# EAGLE design Mounts-Rev4 (EAGLE 9.6.2)

## Sheet 1 of 2
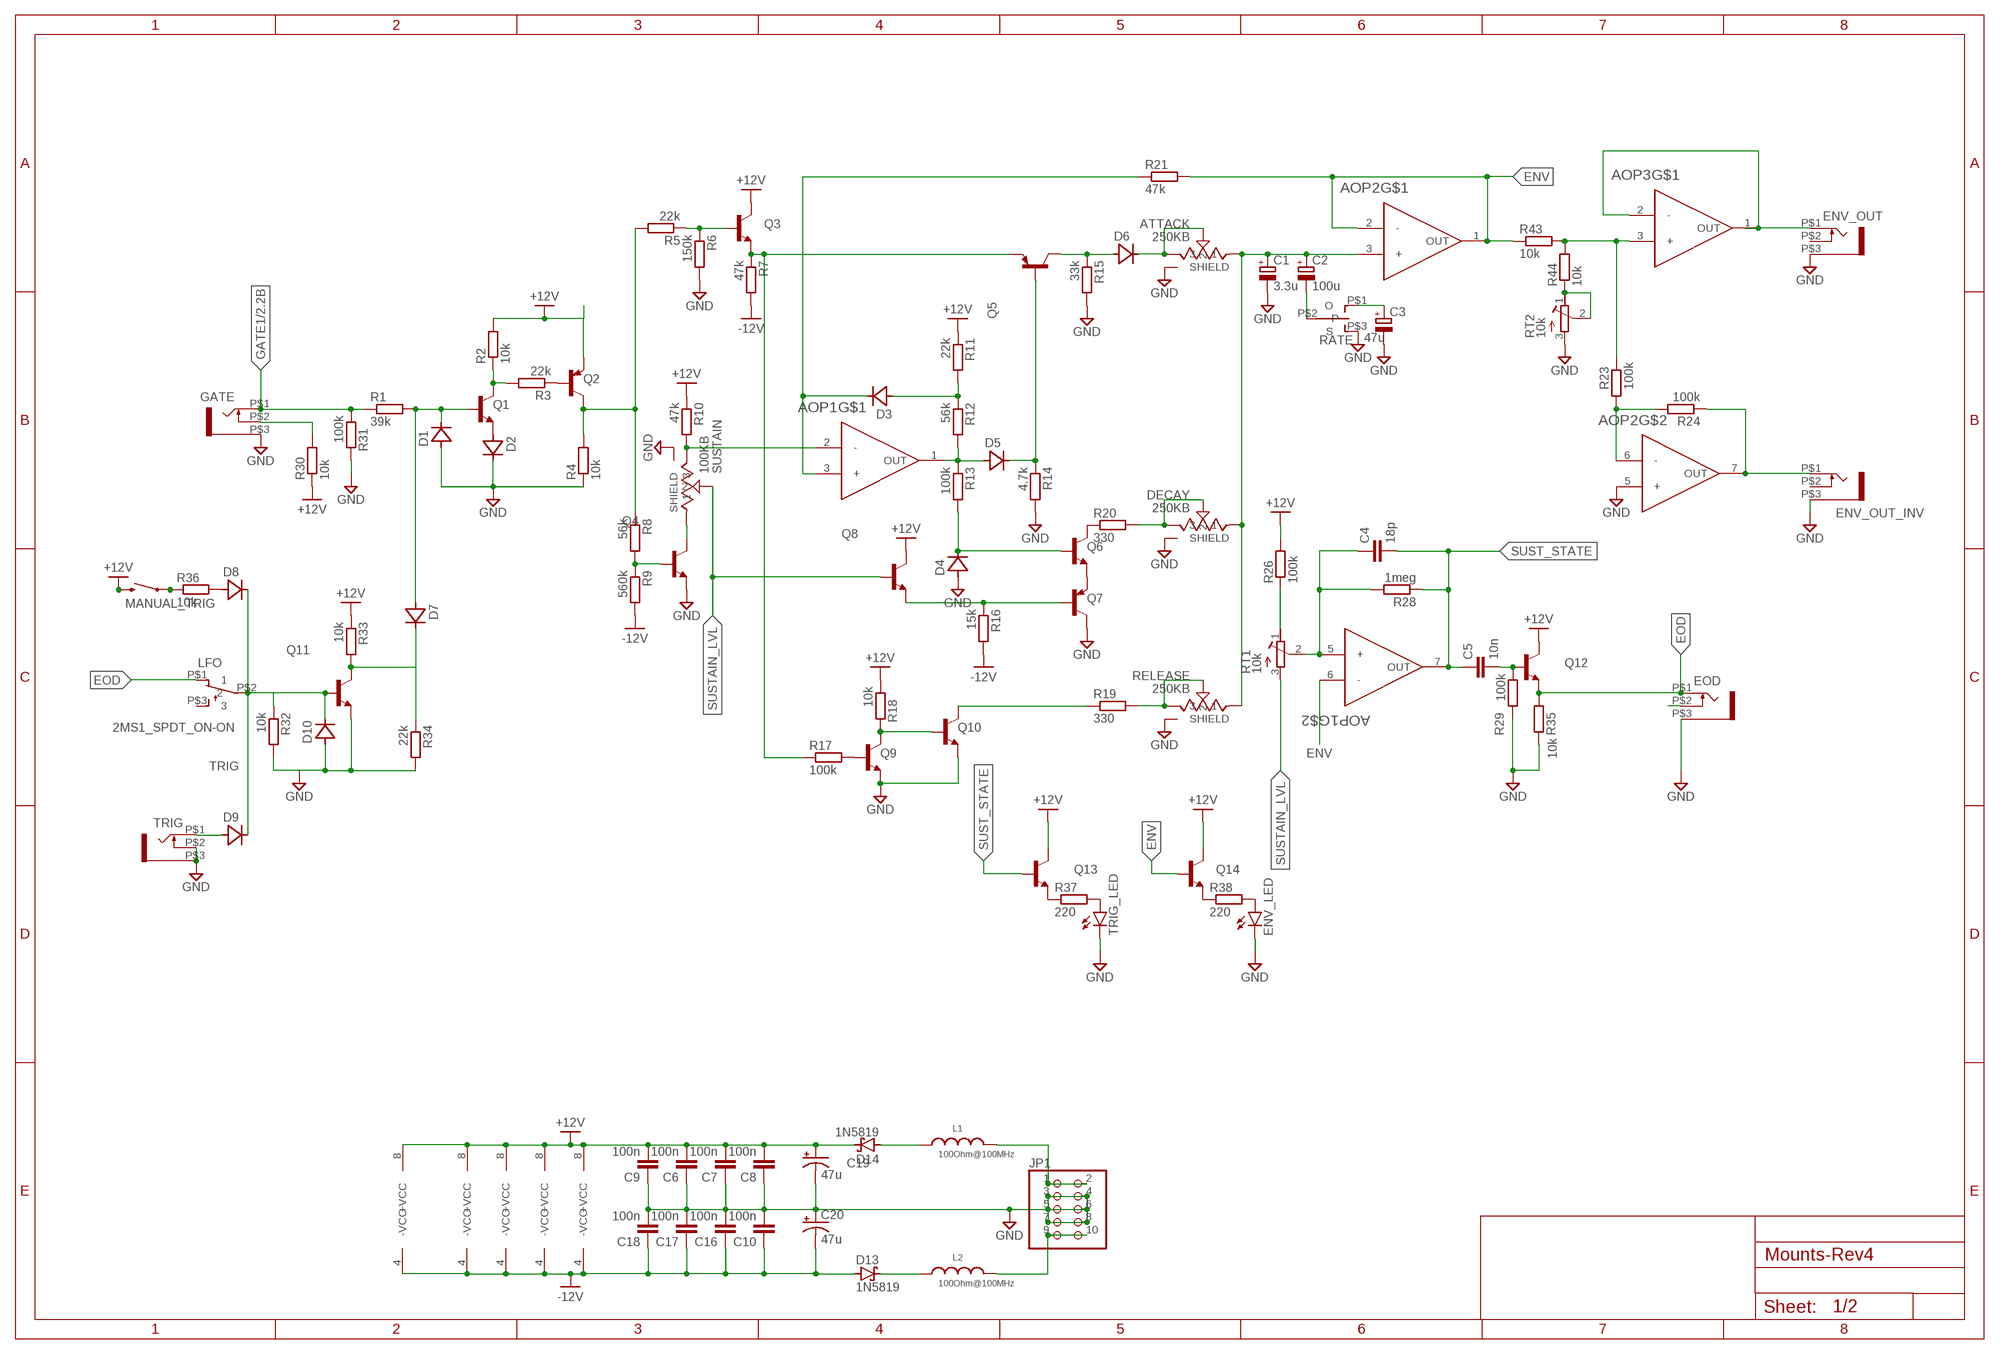
[diagram p0: schematic, sheet 1]

### Parts
AOP1  TL072ACDR  [SOIC8]
AOP2  TL072ACDR  [SOIC8]
AOP3  TL072ACDR  [SOIC8]
AOP5  TL072ACDR  [SOIC8]
AOP6  TL072ACDR  [SOIC8]
ATTACK  250KB  PTA2043  [TRIM_PTA2043-2015CPB]
C1  3.3u  CPOL-EU153CLV-0405  [153CLV-0405]
C2  100u  CPOL-EU153CLV-0605  [153CLV-0605]
C3  47u  CPOL-EU153CLV-0605  [153CLV-0605]
C4  18p  C-EUC0603  [C0603]
C5  10n  C-EUC0603  [C0603]
C6  100n  C-EUC0603  [C0603]
C7  100n  C-EUC0603  [C0603]
C8  100n  C-EUC0603  [C0603]
C9  100n  C-EUC0603  [C0603]
C10  100n  C-EUC0603  [C0603]
C16  100n  C-EUC0603  [C0603]
C17  100n  C-EUC0603  [C0603]
C18  100n  C-EUC0603  [C0603]
C19  47u  CPOL-USC  [PANASONIC_C]
C20  47u  CPOL-USC  [PANASONIC_C]
D1  1N4148WX  [SOD323-W]
D2  1N4148WX  [SOD323-W]
D3  1N4148WX  [SOD323-W]
D4  1N4148WX  [SOD323-W]
D5  1N4148WX  [SOD323-W]
D6  1N4148WX  [SOD323-W]
D7  1N4148WX  [SOD323-W]
D8  1N4148WX  [SOD323-W]
D9  1N4148WX  [SOD323-W]
D10  1N4148WX  [SOD323-W]
D13  1N5819  [SOD123]
D14  1N5819  [SOD123]
DECAY  250KB  PTA2043  [TRIM_PTA2043-2015CPB]
ENV_LED  LED3MM  [LED3MM]
ENV_OUT  WQP-PJ301M-12_JACK  [WQP-PJ301M-12_JACK]
ENV_OUT_INV  WQP-PJ301M-12_JACK  [WQP-PJ301M-12_JACK]
EOD  WQP-PJ301M-12_JACK  [WQP-PJ301M-12_JACK]
GATE  WQP-PJ301M-12_JACK  [WQP-PJ301M-12_JACK]
JP1  PINHD-2X5  [2X05]
L1  100Ohm@100MHz  WE-CBA_0603_782631101_WB/HS  [WE-CBA_0603(W=2.2)]
L2  100Ohm@100MHz  WE-CBA_0603_782631101_WB/HS  [WE-CBA_0603(W=2.2)]
LFO  2MS1_SPDT_ON-ON  [5FS1_SPDT]
MANUAL_TRIG  MOMENTARY-SWITCH-SPST-PTH-6.0MM  [TACTILE_SWITCH_PTH_6.0MM]
Q1  MMBT3904  [SOT23]
Q2  MMBT3906  [SOT23]
Q3  MMBT3904  [SOT23]
Q4  MMBT3904  [SOT23]
Q5  MMBT3906  [SOT23]
Q6  MMBT3904  [SOT23]
Q7  MMBT3906  [SOT23]
Q8  MMBT3904  [SOT23]
Q9  MMBT3904  [SOT23]
Q10  MMBT3904  [SOT23]
Q11  MMBT3904  [SOT23]
Q12  MMBT3904  [SOT23]
Q13  MMBT3904  [SOT23]
Q14  MMBT3904  [SOT23]
R1  39k  R-EU_R0603  [R0603]
R2  10k  R-EU_R0603  [R0603]
R3  22k  R-EU_R0603  [R0603]
R4  10k  R-EU_R0603  [R0603]
R5  22k  R-EU_R0603  [R0603]
R6  150k  R-EU_R0603  [R0603]
R7  47k  R-EU_R0603  [R0603]
R8  56k  R-EU_R0603  [R0603]
R9  560k  R-EU_R0603  [R0603]
R10  47k  R-EU_R0603  [R0603]
R11  22k  R-EU_R0603  [R0603]
R12  56k  R-EU_R0603  [R0603]
R13  100k  R-EU_R0603  [R0603]
R14  4.7k  R-EU_R0603  [R0603]
R15  33k  R-EU_R0603  [R0603]
R16  15k  R-EU_R0603  [R0603]
R17  100k  R-EU_R0603  [R0603]
R18  10k  R-EU_R0603  [R0603]
R19  330  R-EU_R0603  [R0603]
R20  330  R-EU_R0603  [R0603]
R21  47k  R-EU_R0603  [R0603]
R23  100k  R-EU_R0603  [R0603]
R24  100k  R-EU_R0603  [R0603]
R26  100k  R-EU_R0603  [R0603]
R28  1meg  R-EU_R0603  [R0603]
R29  100k  R-EU_R0603  [R0603]
R30  10k  R-EU_R0603  [R0603]
R31  100k  R-EU_R0603  [R0603]
R32  10k  R-EU_R0603  [R0603]
R33  10k  R-EU_R0603  [R0603]
R34  22k  R-EU_R0603  [R0603]
R35  10k  R-EU_R0603  [R0603]
R36  10k  R-EU_R0603  [R0603]
R37  220  R-EU_R0603  [R0603]
R38  220  R-EU_R0603  [R0603]
R43  10k  R-EU_R0603  [R0603]
R44  10k  R-EU_R0603  [R0603]
RATE  5FS1_SPDT_ON-OFF-ON  [5FS1_SPDT]
RELEASE  250KB  PTA2043  [TRIM_PTA2043-2015CPB]
RT1  10k  R-TRIMM3314G  [RTRIM3314G]
RT2  10k  R-TRIMM3314G  [RTRIM3314G]
SUSTAIN  100KB  PTA2043  [TRIM_PTA2043-2015CPB]
TRIG  WQP-PJ301M-12_JACK  [WQP-PJ301M-12_JACK]
TRIG_LED  LED3MM  [LED3MM]

### Nets
ENV: AOP1.6(-) AOP2.1(OUT) AOP2.2(-) Q14.1(B) R21.2 R43.1
EOD: EOD.P$1 LFO.P$1 Q12.2(E) R35.1
GATE1: GATE.P$1 R1.1 R31.1 ; also sheet 2
GND: AOP2.5(+) ATTACK.P1(SHIELD) ATTACK.P2(SHIELD) ATTACK.P3(SHIELD) ATTACK.P4(SHIELD) C1.- C3.- C6.1 C7.1 C8.1 C9.1 C10.2 C16.2 C17.2 C18.2 C19.- C20.+ D1.A D2.C D4.A D10.A DECAY.P1(SHIELD) DECAY.P2(SHIELD) DECAY.P3(SHIELD) DECAY.P4(SHIELD) ENV_LED.K(C) ENV_OUT.P$3 ENV_OUT_INV.P$3 EOD.P$3 GATE.P$3 JP1.3 JP1.4 JP1.5 JP1.6 JP1.7 JP1.8 Q4.2(E) Q7.3(C) Q9.2(E) Q10.2(E) Q11.2(E) R4.1 R6.2 R14.2 R15.2 R29.2 R31.2 R32.2 R34.2 R35.2 RATE.P$3(S) RELEASE.P1(SHIELD) RELEASE.P2(SHIELD) RELEASE.P3(SHIELD) RELEASE.P4(SHIELD) RT2.3(A) SUSTAIN.P1(SHIELD) SUSTAIN.P2(SHIELD) SUSTAIN.P3(SHIELD) SUSTAIN.P4(SHIELD) TRIG.P$2 TRIG.P$3 TRIG_LED.K(C) ; also sheet 2
N$2: D2.A Q1.2(E)
N$3: D1.C D7.A Q1.1(B) R1.2
N$4: Q3.1(B) R5.1 R6.1
N$5: Q2.1(B) R3.1
N$6: JP1.1 JP1.2 L1.2
N$7: Q1.3(C) R2.1 R3.2
N$8: AOP1.3(+) D3.C R21.1
N$9: Q3.2(E) Q5.2(E) R7.1 R17.1
N$10: Q4.1(B) R8.2 R9.1
N$11: AOP1.5(+) C4.1 R28.2 RT1.2(S)
N$12: Q6.2(E) Q7.2(E)
N$13: D3.A R11.2 R12.1
N$14: AOP1.1(OUT) D5.A R12.2 R13.1
N$15: D4.C Q6.1(B) R13.2
N$16: D5.C Q5.1(B) R14.1
N$17: D6.A Q5.3(C) R15.1
N$18: ATTACK.2 ATTACK.3 D6.C
N$19: Q7.1(B) Q8.2(E) R16.1
N$20: Q9.1(B) R17.2
N$21: AOP1.2(-) R10.2 SUSTAIN.3
N$22: Q9.3(C) Q10.1(B) R18.2
N$23: Q10.3(C) R19.1
N$24: Q6.3(C) R20.1
N$25: DECAY.2 DECAY.3 R20.2
N$26: R19.2 RELEASE.2 RELEASE.3
N$27: AOP2.3(+) ATTACK.1 C1.+ C2.+ DECAY.1 RELEASE.1
N$28: Q4.3(C) SUSTAIN.1
N$29: AOP2.6(-) R23.1 R24.2
N$30: AOP3.1(OUT) AOP3.2(-) ENV_OUT.P$1
N$31: GATE.P$2 R30.2
N$32: Q2.3(C) R4.2 R5.2 R8.1
N$33: R26.1 RT1.1(E)
N$35: D8.A R36.2
N$36: R44.1 RT2.1(E) RT2.2(S)
N$37: D9.A TRIG.P$1
N$38: D7.C Q11.3(C) R33.2 R34.1
N$39: C5.2 Q12.1(B) R29.1
N$40: MANUAL_TRIG.3 R36.1
N$41: C2.- RATE.P$2(P)
N$42: C3.+ RATE.P$1(O)
N$43: Q13.2(E) R37.1
N$44: R37.2 TRIG_LED.A
N$45: Q14.2(E) R38.1
N$46: ENV_LED.A R38.2
N$48: AOP2.7(OUT) ENV_OUT_INV.P$1 R24.1
N$49: AOP3.3(+) R23.2 R43.2 R44.2
N$56: JP1.9 JP1.10 L2.2
N$57: D14.A L1.1
N$59: D13.C L2.1
N$69: EOD.P$2
SUST_STATE: AOP1.7(OUT) C4.2 C5.1 Q13.1(B) R28.1
SUSTAIN_LVL: Q8.1(B) RT1.3(A) SUSTAIN.2
TRIG: D8.C D9.C D10.C LFO.P$2 Q11.1(B) R32.1
VCC: AOP1.8(+VCC) AOP2.8(+VCC) AOP3.8(+VCC) AOP5.8(+VCC) AOP6.8(+VCC) C6.2 C7.2 C8.2 C9.2 C19.+ D14.C MANUAL_TRIG.1 Q2.2(E) Q3.3(C) Q8.3(C) Q12.3(C) Q13.3(C) Q14.3(C) R2.2 R10.1 R11.1 R18.1 R26.2 R30.1 R33.1 ; supply symbol labelled +12V ; also sheet 2
VDD: AOP1.4(-VCC) AOP2.4(-VCC) AOP3.4(-VCC) AOP5.4(-VCC) AOP6.4(-VCC) C10.1 C16.1 C17.1 C18.1 C20.- D13.A R7.2 R9.2 R16.2 ; supply symbol labelled -12V ; also sheet 2
Unconnected: ENV_OUT.P$2 ENV_OUT_INV.P$2 LFO.P$3

## Sheet 2 of 2
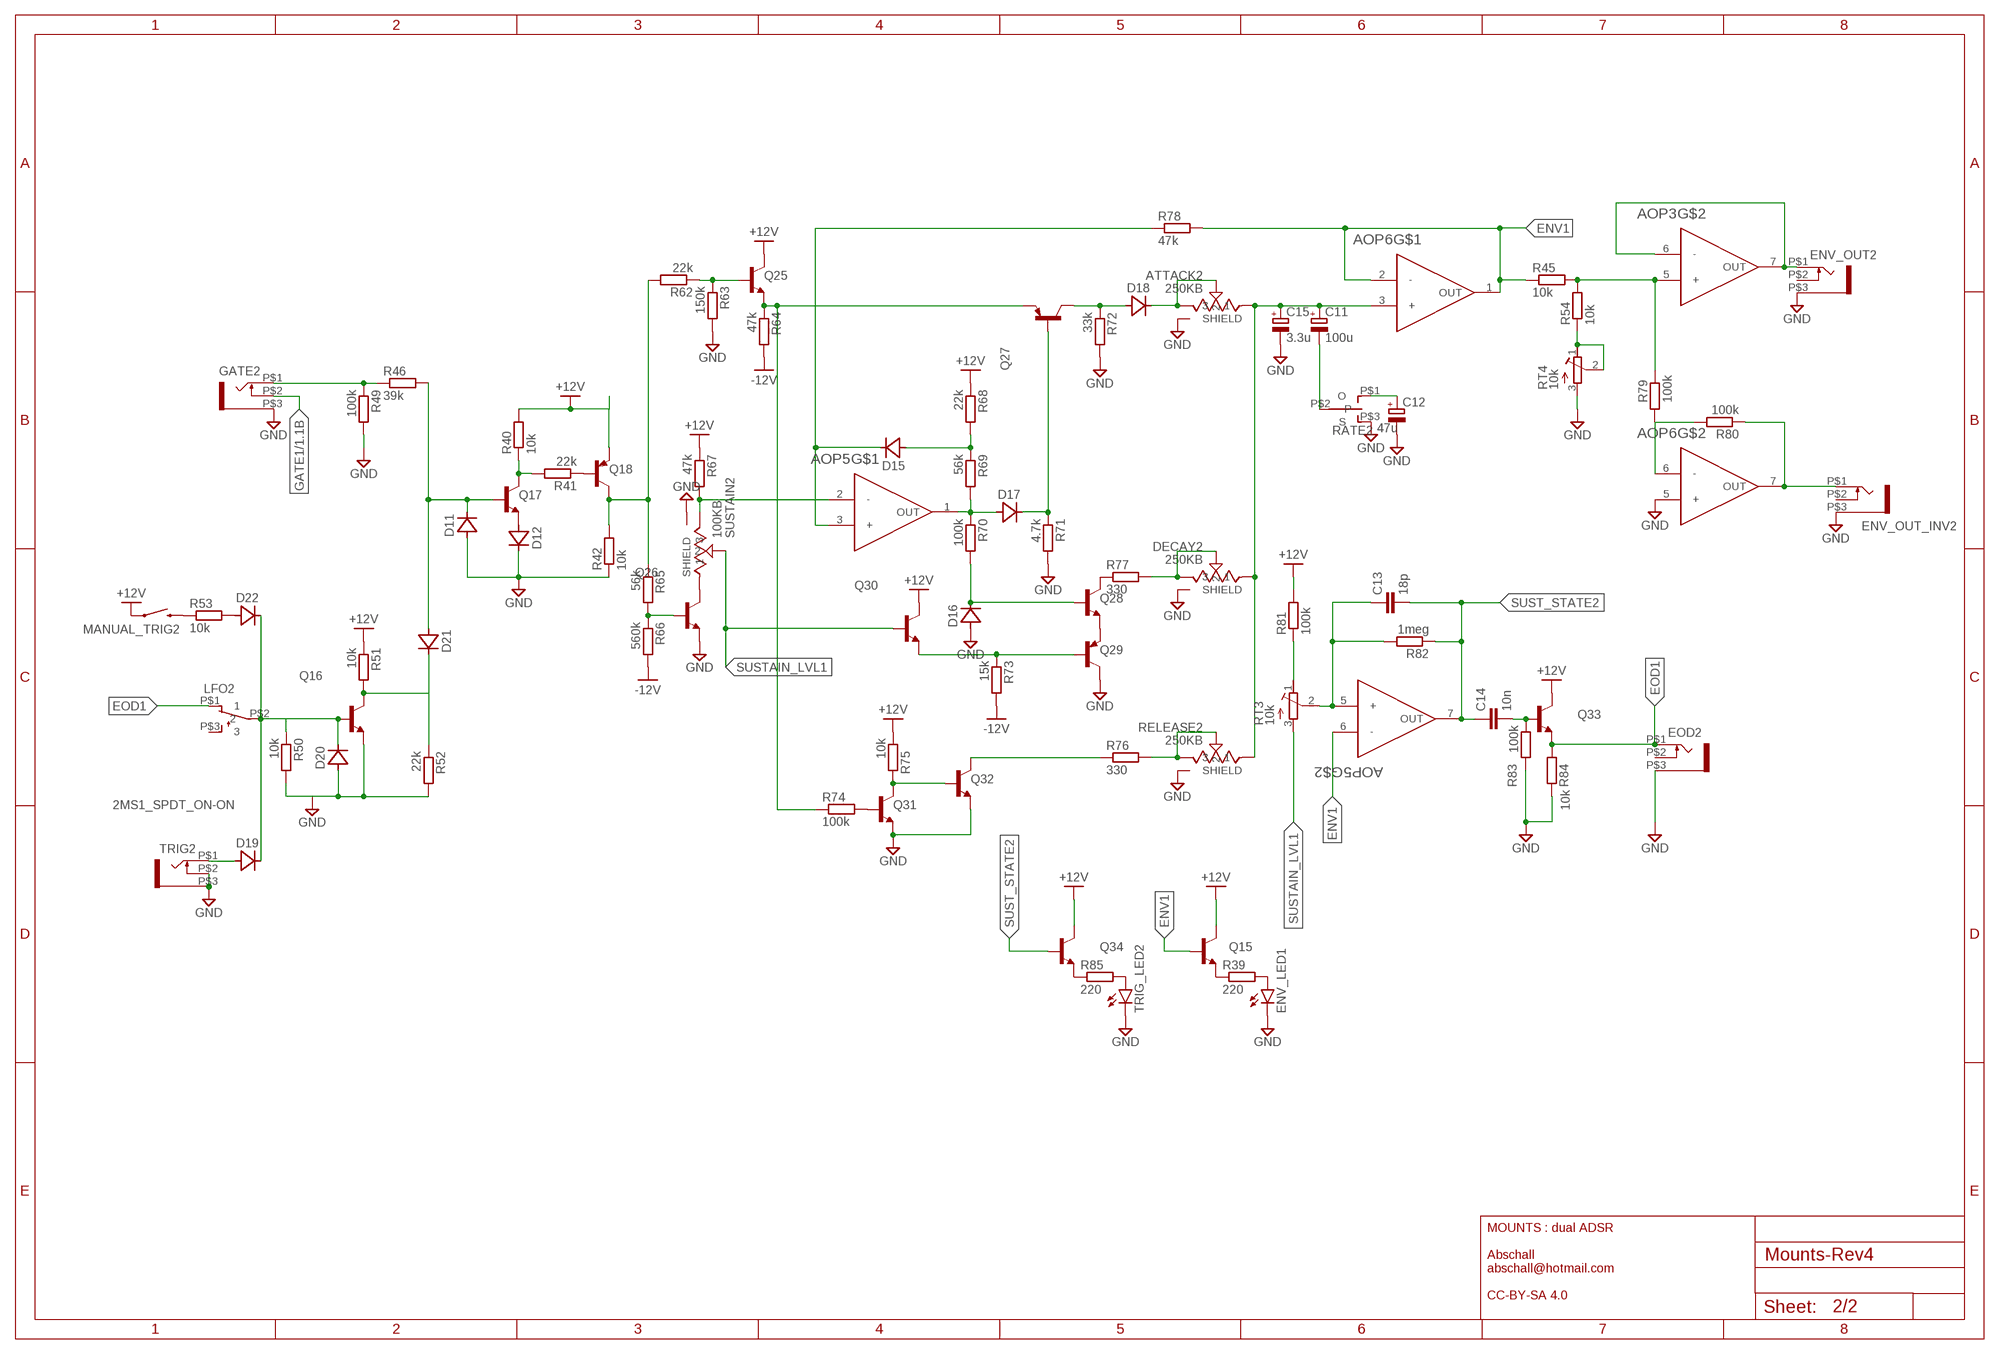
[diagram p1: schematic, sheet 2]

### Parts
ATTACK2  250KB  PTA2043  [TRIM_PTA2043-2015CPB]
C11  100u  CPOL-EU153CLV-0605  [153CLV-0605]
C12  47u  CPOL-EU153CLV-0605  [153CLV-0605]
C13  18p  C-EUC0603  [C0603]
C14  10n  C-EUC0603  [C0603]
C15  3.3u  CPOL-EU153CLV-0405  [153CLV-0405]
D11  1N4148WX  [SOD323-W]
D12  1N4148WX  [SOD323-W]
D15  1N4148WX  [SOD323-W]
D16  1N4148WX  [SOD323-W]
D17  1N4148WX  [SOD323-W]
D18  1N4148WX  [SOD323-W]
D19  1N4148WX  [SOD323-W]
D20  1N4148WX  [SOD323-W]
D21  1N4148WX  [SOD323-W]
D22  1N4148WX  [SOD323-W]
DECAY2  250KB  PTA2043  [TRIM_PTA2043-2015CPB]
ENV_LED1  LED3MM  [LED3MM]
ENV_OUT2  WQP-PJ301M-12_JACK  [WQP-PJ301M-12_JACK]
ENV_OUT_INV2  WQP-PJ301M-12_JACK  [WQP-PJ301M-12_JACK]
EOD2  WQP-PJ301M-12_JACK  [WQP-PJ301M-12_JACK]
GATE2  WQP-PJ301M-12_JACK  [WQP-PJ301M-12_JACK]
LFO2  2MS1_SPDT_ON-ON  [5FS1_SPDT]
MANUAL_TRIG2  MOMENTARY-SWITCH-SPST-PTH-6.0MM  [TACTILE_SWITCH_PTH_6.0MM]
Q15  MMBT3904  [SOT23]
Q16  MMBT3904  [SOT23]
Q17  MMBT3904  [SOT23]
Q18  MMBT3906  [SOT23]
Q25  MMBT3904  [SOT23]
Q26  MMBT3904  [SOT23]
Q27  MMBT3906  [SOT23]
Q28  MMBT3904  [SOT23]
Q29  MMBT3906  [SOT23]
Q30  MMBT3904  [SOT23]
Q31  MMBT3904  [SOT23]
Q32  MMBT3904  [SOT23]
Q33  MMBT3904  [SOT23]
Q34  MMBT3904  [SOT23]
R39  220  R-EU_R0603  [R0603]
R40  10k  R-EU_R0603  [R0603]
R41  22k  R-EU_R0603  [R0603]
R42  10k  R-EU_R0603  [R0603]
R45  10k  R-EU_R0603  [R0603]
R46  39k  R-EU_R0603  [R0603]
R49  100k  R-EU_R0603  [R0603]
R50  10k  R-EU_R0603  [R0603]
R51  10k  R-EU_R0603  [R0603]
R52  22k  R-EU_R0603  [R0603]
R53  10k  R-EU_R0603  [R0603]
R54  10k  R-EU_R0603  [R0603]
R62  22k  R-EU_R0603  [R0603]
R63  150k  R-EU_R0603  [R0603]
R64  47k  R-EU_R0603  [R0603]
R65  56k  R-EU_R0603  [R0603]
R66  560k  R-EU_R0603  [R0603]
R67  47k  R-EU_R0603  [R0603]
R68  22k  R-EU_R0603  [R0603]
R69  56k  R-EU_R0603  [R0603]
R70  100k  R-EU_R0603  [R0603]
R71  4.7k  R-EU_R0603  [R0603]
R72  33k  R-EU_R0603  [R0603]
R73  15k  R-EU_R0603  [R0603]
R74  100k  R-EU_R0603  [R0603]
R75  10k  R-EU_R0603  [R0603]
R76  330  R-EU_R0603  [R0603]
R77  330  R-EU_R0603  [R0603]
R78  47k  R-EU_R0603  [R0603]
R79  100k  R-EU_R0603  [R0603]
R80  100k  R-EU_R0603  [R0603]
R81  100k  R-EU_R0603  [R0603]
R82  1meg  R-EU_R0603  [R0603]
R83  100k  R-EU_R0603  [R0603]
R84  10k  R-EU_R0603  [R0603]
R85  220  R-EU_R0603  [R0603]
RATE2  5FS1_SPDT_ON-OFF-ON  [5FS1_SPDT]
RELEASE2  250KB  PTA2043  [TRIM_PTA2043-2015CPB]
RT3  10k  R-TRIMM3314G  [RTRIM3314G]
RT4  10k  R-TRIMM3314G  [RTRIM3314G]
SUSTAIN2  100KB  PTA2043  [TRIM_PTA2043-2015CPB]
TRIG2  WQP-PJ301M-12_JACK  [WQP-PJ301M-12_JACK]
TRIG_LED2  LED3MM  [LED3MM]

### Nets
ENV1: AOP5.6(-) AOP6.1(OUT) AOP6.2(-) Q15.1(B) R45.1 R78.2
EOD1: EOD2.P$1 LFO2.P$1 Q33.2(E) R84.1
GATE1: GATE2.P$2 ; also sheet 1
GND: AOP6.5(+) ATTACK2.P1(SHIELD) ATTACK2.P2(SHIELD) ATTACK2.P3(SHIELD) ATTACK2.P4(SHIELD) C12.- C15.- D11.A D12.C D16.A D20.A DECAY2.P1(SHIELD) DECAY2.P2(SHIELD) DECAY2.P3(SHIELD) DECAY2.P4(SHIELD) ENV_LED1.K(C) ENV_OUT2.P$3 ENV_OUT_INV2.P$3 EOD2.P$3 GATE2.P$3 Q16.2(E) Q26.2(E) Q29.3(C) Q31.2(E) Q32.2(E) R42.1 R49.2 R50.2 R52.2 R63.2 R71.2 R72.2 R83.2 R84.2 RATE2.P$3(S) RELEASE2.P1(SHIELD) RELEASE2.P2(SHIELD) RELEASE2.P3(SHIELD) RELEASE2.P4(SHIELD) RT4.3(A) SUSTAIN2.P1(SHIELD) SUSTAIN2.P2(SHIELD) SUSTAIN2.P3(SHIELD) SUSTAIN2.P4(SHIELD) TRIG2.P$2 TRIG2.P$3 TRIG_LED2.K(C) ; also sheet 1
N$1: AOP6.6(-) R79.1 R80.2
N$34: AOP3.5(+) R45.2 R54.2 R79.2
N$47: D12.A Q17.2(E)
N$50: Q15.2(E) R39.1
N$51: ENV_LED1.A R39.2
N$52: D11.C D21.A Q17.1(B) R46.2
N$53: Q18.1(B) R41.1
N$54: Q17.3(C) R40.1 R41.2
N$55: Q18.3(C) R42.2 R62.2 R65.1
N$58: GATE2.P$1 R46.1 R49.1
N$60: R54.1 RT4.1(E) RT4.2(S)
N$61: D21.C Q16.3(C) R51.2 R52.1
N$62: D19.A TRIG2.P$1
N$63: D22.A R53.2
N$64: MANUAL_TRIG2.3 R53.1
N$65: AOP3.6(-) AOP3.7(OUT) ENV_OUT2.P$1
N$70: AOP5.2(-) R67.2 SUSTAIN2.3
N$71: Q26.3(C) SUSTAIN2.1
N$84: Q25.1(B) R62.1 R63.1
N$85: Q25.2(E) Q27.2(E) R64.1 R74.1
N$86: Q26.1(B) R65.2 R66.1
N$87: AOP5.3(+) D15.C R78.1
N$88: D15.A R68.2 R69.1
N$89: AOP5.1(OUT) D17.A R69.2 R70.1
N$90: D16.C Q28.1(B) R70.2
N$91: D17.C Q27.1(B) R71.1
N$92: D18.A Q27.3(C) R72.1
N$93: ATTACK2.2 ATTACK2.3 D18.C
N$94: Q28.2(E) Q29.2(E)
N$95: Q29.1(B) Q30.2(E) R73.1
N$97: Q31.1(B) R74.2
N$98: Q31.3(C) Q32.1(B) R75.2
N$99: Q32.3(C) R76.1
N$100: Q28.3(C) R77.1
N$101: DECAY2.2 DECAY2.3 R77.2
N$102: R76.2 RELEASE2.2 RELEASE2.3
N$103: AOP6.3(+) ATTACK2.1 C11.+ C15.+ DECAY2.1 RELEASE2.1
N$105: AOP6.7(OUT) ENV_OUT_INV2.P$1 R80.1
N$106: R81.1 RT3.1(E)
N$107: AOP5.5(+) C13.1 R82.2 RT3.2(S)
N$109: C14.2 Q33.1(B) R83.1
N$110: C11.- RATE2.P$2(P)
N$111: C12.+ RATE2.P$1(O)
N$112: Q34.2(E) R85.1
N$113: R85.2 TRIG_LED2.A
SUST_STATE2: AOP5.7(OUT) C13.2 C14.1 Q34.1(B) R82.1
SUSTAIN_LVL1: Q30.1(B) RT3.3(A) SUSTAIN2.2
TRIG1: D19.C D20.C D22.C LFO2.P$2 Q16.1(B) R50.1
VCC: MANUAL_TRIG2.1 Q15.3(C) Q18.2(E) Q25.3(C) Q30.3(C) Q33.3(C) Q34.3(C) R40.2 R51.1 R67.1 R68.1 R75.1 R81.2 ; supply symbol labelled +12V ; also sheet 1
VDD: R64.2 R66.2 R73.2 ; supply symbol labelled -12V ; also sheet 1
Unconnected: ENV_OUT2.P$2 ENV_OUT_INV2.P$2 EOD2.P$2 LFO2.P$3

### Notes on the sheet
- MOUNTS : dual ADSR
  
  Abschall
  abschall@hotmail.com
  
  CC-BY-SA 4.0

## Library data of the parts
AOP1 = personal devices:TL072ACDR; SPICEPREFIX: J
AOP2 AOP3 AOP5 AOP6 = personal devices:TL072ACDR
ATTACK ATTACK2 DECAY DECAY2 RELEASE RELEASE2 SUSTAIN SUSTAIN2 = potentiometer:PTA2043
C1-C3 C11 C12 C15 = resistor:CPOL-EU: POLARIZED CAPACITOR, European symbol
C4-C10 C13 C14 C16-C18 = resistor:C-EU: CAPACITOR, European symbol
C19 C20 = rcl:CPOL-US: POLARIZED CAPACITOR, American symbol
D1-D12 D15-D22 = personal devices:1N4148WX
D13 D14 = personal-ICs:1N5819
ENV_LED ENV_LED1 TRIG_LED TRIG_LED2 = led:LED: LED OSRAM: - CHIPLED LG R971, LG N971, LY N971, LG Q971, LY Q971, LO R971, LY R971 LH N974, LH R974 LS Q976, LO Q976, LY Q976 LO Q996 - Hyper CHIPLED LW Q18S LB Q993, LB Q99A, LB R99A - SideLED LS A670, LO A670, LY A670, LG A670, LP A670 LB A673, LV A673, LT A673, LW A673 LH A674 LY A675 LS A676, LA A676, LO A676, LY A676, LW A676 LS A679, LY A679, LG A679 - Hyper Micro SIDELED® LS Y876, LA Y876, LO Y876, LY Y876 LT Y87S - SmartLED LW L88C, LW L88S LB L89C, LB L89S, LG L890 LS L89K, LO L89K, LY L89K LS L896, LA L896, LO L896, LY L896 - TOPLED LS T670, LO T670, LY T670, LG T670, LP T670 LSG T670, LSP T670, LSY T670, LOP T670, LYG T670 LG T671, LOG T671, LSG T671 LB T673, LV T673, LT T673, LW T673 LH T674 LS T676, LA T676, LO T676, LY T676, LB T676, LH T676, LSB T676, LW T676 LB T67C, LV T67C, LT T67C, LS T67K, LO T67K, LY T67K, LW E67C LS E67B, LA E67B, LO E67B, LY E67B, LB E67C, LV E67C, LT E67C LW T67C LS T679, LY T679, LG T679 LS T770, LO T770, LY T770, LG T770, LP T770 LB T773, LV T773, LT T773, LW T773 LH T774 LS E675, LA E675, LY E675, LS T675 LS T776, LA T776, LO T776, LY T776, LB T776 LHGB T686 LT T68C, LB T68C - Hyper Mini TOPLED® LB M676 - Mini TOPLED Santana® LG M470 LS M47K, LO M47K, LY M47K Source: http://www.osram.convergy.de LUXEON: - LUMILED® LXK2-PW12-R00, LXK2-PW12-S00, LXK2-PW14-U00, LXK2-PW14-V00 LXK2-PM12-R00, LXK2-PM12-S00, LXK2-PM14-U00 LXK2-PE12-Q00, LXK2-PE12-R00, LXK2-PE12-S00, LXK2-PE14-T00, LXK2-PE14-U00 LXK2-PB12-K00, LXK2-PB12-L00, LXK2-PB12-M00, LXK2-PB14-N00, LXK2-PB14-P00, LXK2-PB14-Q00 LXK2-PR12-L00, LXK2-PR12-M00, LXK2-PR14-Q00, LXK2-PR14-R00 LXK2-PD12-Q00, LXK2-PD12-R00, LXK2-PD12-S00 LXK2-PH12-R00, LXK2-PH12-S00 LXK2-PL12-P00, LXK2-PL12-Q00, LXK2-PL12-R00 Source: www.luxeon.com KINGBRIGHT: KA-3528ASYC Source: www.kingbright.com
ENV_OUT ENV_OUT2 ENV_OUT_INV ENV_OUT_INV2 EOD EOD2 GATE GATE2 TRIG TRIG2 = thonkiconn:WQP-PJ301M-12_JACK
JP1 = pinhead:PINHD-2X5: PIN HEADER
L1 L2 = Wurth_Automotive_WE-CBA:WE-CBA_0603: WE-CBA SMD EMI Suppression Ferrite Bead Characteristics Reliable Ni-Sn electrodes High rated current up to 5A Recommended soldering: Reflow Operating temperature: -55°C to +125°C Applications * Perfect as data line filter and for uncoupling of distribution voltage *This special SMD chip bead ferrites can be put directly on the printed circuit board. They offer excellent anti-EMI properties and low DC-resistance. Placed very close next to the interference source even with smallest size 0402,maximal impedance at 1000 Ω can be reached. *High Speed: "High Speed " SMD ferrites WE-CBF have lower impedance in the lower frequency ranges thus they have only a low attenuation for fast signals. Application e.g. USB 2.0, IEEE 1394,LVDS *Wide Band: "Wide Band" SMD ferrites WE-CBF already show high impedance in low frequency range. Therefore they are wide band through the whole spectrum. Application e.g. control signats, RS232, RS422, DC/DC converter *High Current: "High Current " SMD ferrites WE-CBF are designed for high current (over 1 A). The rated current refers to 40K self-heating. High current SMD ferrites are available in all there types (High Speed, Wide Band and High Frequency). Application e.g. power supply, DC/DC converter *Advice: Pay attention for the use of SMD-Ferrites for high current>1A and ambient temperature over +85°C that the rated current has to be reduced when temperature is above +85°C (Derating). *At+100°C environment temperature the maximal rated current has to add up to only 60% of the data sheet value ,without an overload of the component. Variant abbreviation WB means WIDE BAND HS means HIGH SPEED HC means HIGH CURRENT <https://katalog.we-online.de/media/images/v2/o14751v209%20Family_WE-CBA.jpg> Details see: https://www.we-online.com/catalog/en/WE-CBA/ Updated by Ella Wu 2019-12-09 2019(C) Wurth Elektronik; DATASHEET-URL: https://www.we-online.com/catalog/datasheet/782631101.pdf; IR1: 500mA; MOUNT: SMT; PART-NUMBER: 782631101; RDC-MAX: 0.2Ohm; TYPE: High Speed; ZMAX: 610Ohm
LFO LFO2 = personal devices:2MS1_SPDT_ON-ON
MANUAL_TRIG MANUAL_TRIG2 = SparkFun-Switches:MOMENTARY-SWITCH-SPST: Momentary Switch (Pushbutton) - SPST Normally-open (NO) SPST momentary switches (buttons, pushbuttons). Variants PTH-12MM - 12mm square, through-hole Momentary Pushbutton Switch - 12mm Square <https://www.sparkfun.com/products/9190> (COM-09190) PTH-6.0MM, PTH-6.0MM-KIT - 6.0mm square, through-hole Mini Pushbutton Switch <https://www.sparkfun.com/products/97> (COM-00097) KIT package intended for soldering kit's - only one side of pads' copper is exposed. PTH-RIGHT-ANGLE-KIT - Right-angle, through-hole Right Angle Tactile Button <https://www.sparkfun.com/products/10791> - Used on SparkFun BigTime Watch Kit <https://www.sparkfun.com/products/11734> SMD-12MM - 12mm square, surface-mount Tactile Button - SMD (12mm) <https://www.sparkfun.com/products/12993> (COM-12993) Used on SparkFun PicoBoard <https://www.sparkfun.com/products/11888> SMD-4.5MM - 4.5mm Square Trackball Switch Used on SparkFun Blackberry Trackballer Breakout <https://www.sparkfun.com/products/13169> SMD-4.6MMX2.8MM - 4.60mm x 2.80mm, surface mount Used on SparkFun SAMD21 Mini Breakout <https://www.sparkfun.com/products/13664> SMD-5.2MM, SMD-5.2-REDUNDANT - 5.2mm square, surface-mount Mini Pushbutton Switch - SMD <https://www.sparkfun.com/products/8720> (COM-08720) Used on Arduino Pro Mini <https://www.sparkfun.com/products/11114> REDUNDANT package connects both switch circuits together SMD-6.0X3.5MM - 6.0 x 3.5mm, surface mount Momentary Reset Switch SMD <https://www.sparkfun.com/products/8229> (COM-08229) SMD-6.2MM-TALL - 6.2mm square, surface mount Tactile Button - SMD (6mm) <https://www.sparkfun.com/products/12992> Used on SparkFun Digital Sandbox <https://www.sparkfun.com/products/12651> SMD-RIGHT-ANGLE - Right-angle, surface mount Used on SparkFun Block for Intel® Edison - Arduino <https://www.sparkfun.com/products/13036>; PROD_ID: SWCH-08441; SF_SKU: COM-00097
Q1 Q3 Q4 Q6 Q8-Q17 Q25 Q26 Q28 Q30-Q34 = personal devices:MMBT3904
Q2 Q5 Q7 Q18 Q27 Q29 = personal devices:MMBT3906
R1-R21 R23 R24 R26 R28-R46 R49-R54 R62-R85 = resistor:R-EU_: RESISTOR, European symbol
RATE RATE2 = personal devices:5FS1_SPDT_ON-OFF-ON: 2.54 pin pitch slide switch ON-OFF-ON same footprint ass thonk mountain switch 2MS1
RT1-RT4 = resistor:R-TRIMM: Trimm resistor

## Board
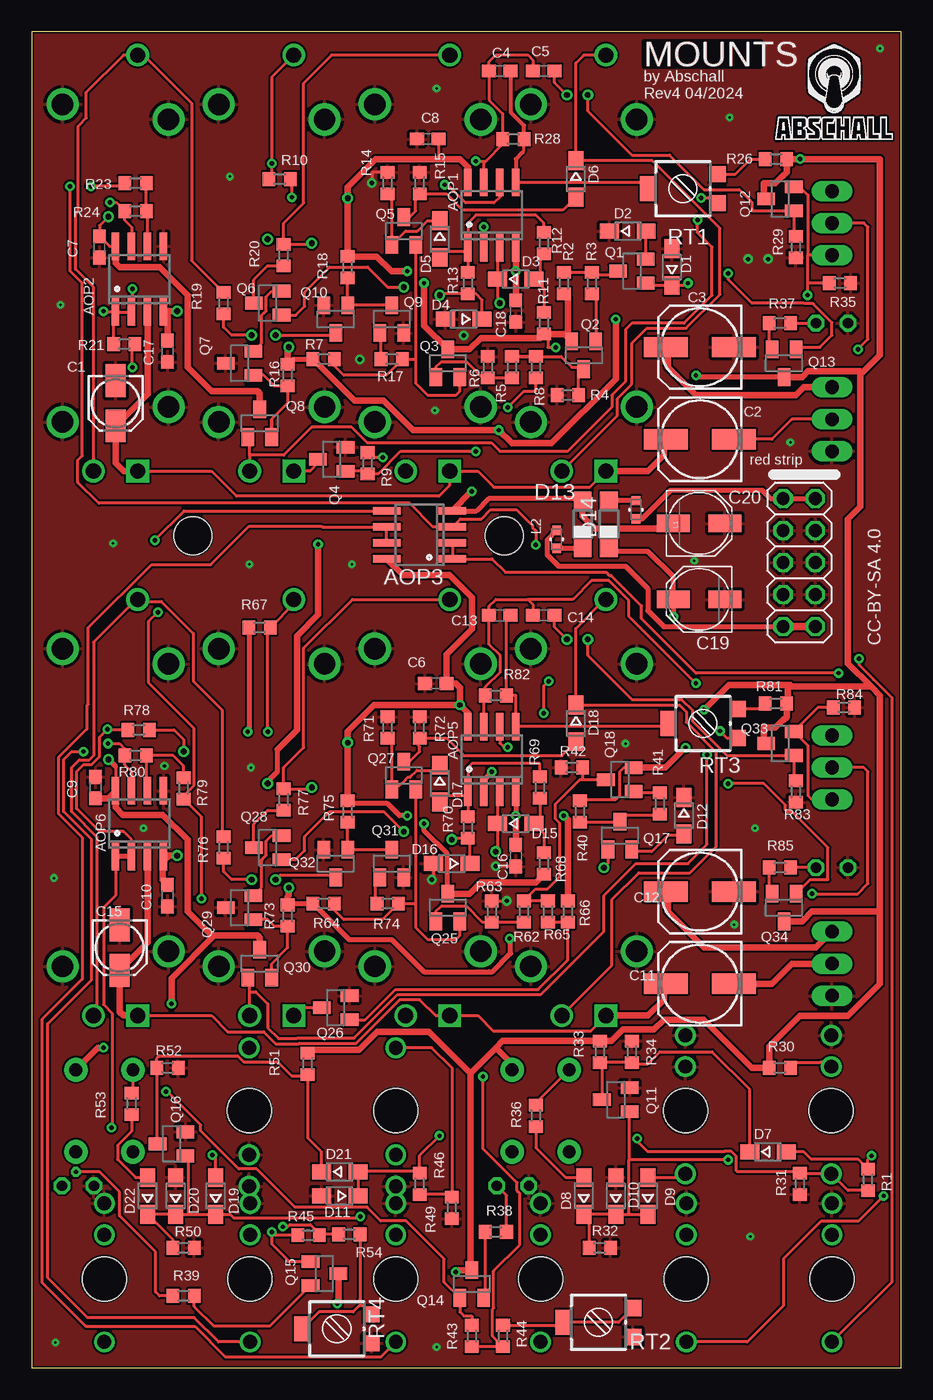
[diagram p2: board, top side]
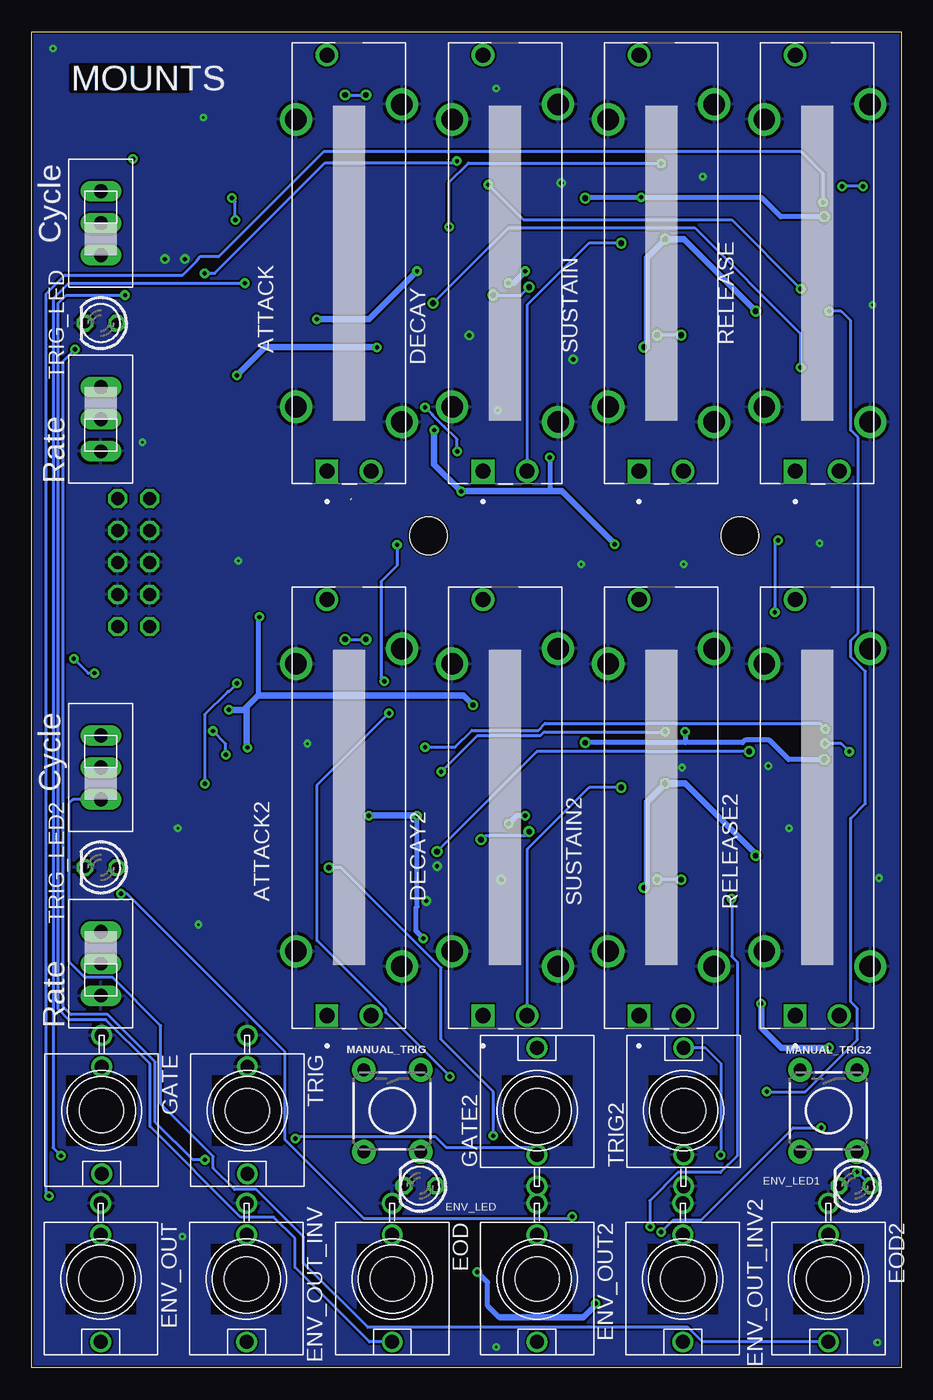
[diagram p3: board, bottom side, seen from below]

Size 69 x 106 mm. Coordinates in mm from the lower left corner, seen from the top.
Outline: 0,0 69,0 69,106 0,106 0,0
Copper layers (1*16): Top 0.035mm / dielectric 1.5mm / Bottom 0.035mm
Design rules "default *": minimum track width 6mil, minimum drill 0.35mm, track to track 6mil, track to pad 6mil, pad to pad 6mil, via to via 6mil, smd to smd 6mil, copper to edge 6mil, drill to drill 6mil, minimum pad ring 10mil, minimum via ring 8mil, stop-mask expansion 4mil, vias tented up to drill 0mil, thermal gap 10mil
Holes 3 mm at 12.8,66 37.5,66

### Footprints (pad centres in the part's own frame; a part is rotated, then mirrored left to right if it is on the bottom)
SOIC8 = smd 0.6 x 2.2: 1 -1.905,-2.6; 2 -0.635,-2.6; 3 0.635,-2.6; 4 1.905,-2.6; 5 1.905,2.6; 6 0.635,2.6; 7 -0.635,2.6; 8 -1.905,2.6
TRIM_PTA2043-2015CPB = drill 1.2 square: 1 -16.5,1.75 | drill 1.2: 2 -16.5,-1.75; 3 16.5,1.75 | drill 1.7: P1 -11.4,4.2; P2 11.4,4.2; P3 -12.6,-4.2; P4 12.6,-4.2
153CLV-0405 = smd 2.6 x 1.6: + 1.8,0; - -1.8,0
153CLV-0605 = smd 3.5 x 1.6: + 2.7,0; - -2.7,0
C0603 = smd 1.1 x 1: 1 -0.85,0; 2 0.85,0
PANASONIC_C = smd 2.6 x 1.4: + 2.05,0; - -2.05,0
SOD323-W = smd 1.5 x 1.2: A 1.45,0; C -1.45,0
SOD123 = smd 1.4 x 1.4: A 1.9,0; C -1.9,0
LED3MM = drill 0.813 octagon: A -1.27,0; K 1.27,0
WQP-PJ301M-12_JACK = drill 1.1: P$1 0,5; P$2 0,-3.5; P$3 0,-5.992 | hole 3.5: 0,0
2X05 = drill 1.016 octagon: 1 -5.08,-1.27; 2 -5.08,1.27; 3 -2.54,-1.27; 4 -2.54,1.27; 5 0,-1.27; 6 0,1.27; 7 2.54,-1.27; 8 2.54,1.27; 9 5.08,-1.27; 10 5.08,1.27
WE-CBA_0603(W=2.2) = smd 0.75 x 0.7: 1 -0.725,0; 2 0.725,0
5FS1_SPDT = drill 1.09 long: P$1 2.54,7.62; P$2 2.54,5.08; P$3 2.54,2.54
TACTILE_SWITCH_PTH_6.0MM = drill 1.016 pad 1.88: 1 -3.251,2.261; 2 3.251,2.261; 3 -3.251,-2.261; 4 3.251,-2.261
SOT23 = smd 1 x 1.4: 1 -0.95,-1.1; 2 0.95,-1.1; 3 0,1.1
R0603 = smd 1 x 1.1: 1 -0.85,0; 2 0.85,0
RTRIM3314G = smd 1.3 x 1.3: 1 1.15,-2.75; 3 -1.15,-2.75 | smd 2 x 1.3: 2 0,2.75

### Placement (x,y rotation side)
AOP1  36.51,91.44 0 top
AOP2  8.57,86.36 0 top
AOP3  30.78,66.07 90 top
AOP5  36.51,48.26 0 top
AOP6  8.57,43.18 0 top
ATTACK  43.81,87.63 90 bottom
ATTACK2  43.81,44.45 90 bottom
C1  6.67,76.52 270 top
C2  53.02,73.66 180 top
C3  53.02,80.96 180 top
C4  37.15,102.87 180 top
C5  40.64,102.87 0 top
C6  32.07,54.29 0 top
C7  5.4,88.9 90 top
C8  31.43,97.47 0 top
C9  5.08,46.04 270 top
C10  10.79,37.47 270 top
C11  53.02,30.48 180 top
C12  53.02,37.78 180 top
C13  37.15,59.69 180 top
C14  40.64,59.69 0 top
C15  6.99,33.34 270 top
C16  38.42,40.64 270 top
C17  10.79,80.64 270 top
C18  38.42,83.82 270 top
C19  52.96,60.96 180 top
C20  52.96,66.99 0 top
D1  50.8,87.31 90 top
D2  47.31,90.17 0 top
D3  38.42,86.36 0 top
D4  34.29,83.19 180 top
D5  32.38,89.53 270 top
D6  43.18,94.3 270 top
D7  58.42,17.14 0 top
D8  43.81,13.65 90 top
D9  48.9,13.65 90 top
D10  46.35,13.65 90 top
D11  24.45,13.65 180 top
D12  51.75,43.81 270 top
D13  43.72,66.93 90 top
D14  45.8,66.93 90 top
D15  38.42,43.18 0 top
D16  33.34,40.01 180 top
D17  32.38,46.35 270 top
D18  43.18,51.12 270 top
D19  14.61,13.65 90 top
D20  11.43,13.65 90 top
D21  24.45,15.56 0 top
D22  9.21,13.65 90 top
DECAY  31.43,87.63 90 bottom
DECAY2  31.43,44.45 90 bottom
ENV_LED  38.18,14.45 180 bottom
ENV_LED1  3.68,14.45 180 bottom
ENV_OUT  63.5,7.06 180 bottom
ENV_OUT2  28.89,7.06 180 bottom
ENV_OUT_INV  51.94,7.06 180 bottom
ENV_OUT_INV2  17.34,7.06 180 bottom
EOD  40.39,7.06 180 bottom
EOD2  5.78,7.06 180 bottom
GATE  63.44,20.4 180 bottom
GATE2  28.89,20.4 0 bottom
JP1  60.9,63.88 270 top
L1  47.94,68.07 270 top
L2  41.66,65.72 90 top
LFO  60.96,95.89 180 bottom
LFO2  60.96,52.7 180 bottom
MANUAL_TRIG  40.39,20.4 270 bottom
MANUAL_TRIG2  5.78,20.4 270 bottom
Q1  47.62,87 90 top
Q2  43.81,80.33 180 top
Q3  33.02,79.69 0 top
Q4  23.81,72.07 90 top
Q5  29.53,90.17 0 top
Q6  18.73,84.45 90 top
Q7  16.51,79.69 90 top
Q8  18.1,74.93 0 top
Q9  28.57,83.19 0 top
Q10  24.13,83.19 180 top
Q11  46.35,21.27 90 top
Q12  59.37,92.71 90 top
Q13  59.69,79.69 180 top
Q14  34.92,6.67 0 top
Q15  23.24,7.49 270 top
Q16  11.11,17.78 90 top
Q17  46.67,42.23 0 top
Q18  46.67,46.67 90 top
Q25  33.02,36.51 0 top
Q26  24.13,28.57 90 top
Q27  29.53,46.99 0 top
Q28  18.73,41.27 90 top
Q29  16.51,36.51 90 top
Q30  18.1,32.07 0 top
Q31  28.57,40.01 0 top
Q32  24.13,40.01 180 top
Q33  59.37,49.53 90 top
Q34  59.69,36.51 180 top
R1  66.36,14.92 90 top
R2  42.23,86.04 270 top
R3  44.45,86.04 90 top
R4  42.55,77.15 0 top
R5  38.1,79.38 90 top
R6  36.2,79.38 90 top
R7  23.18,80.01 180 top
R8  40.01,79.38 270 top
R9  26.67,71.75 90 top
R10  19.68,94.3 180 top
R11  40.64,82.87 90 top
R12  40.64,89.22 90 top
R13  34.61,86.04 270 top
R14  28.26,93.98 90 top
R15  30.8,93.98 90 top
R16  20.32,78.74 90 top
R17  28.57,80.01 180 top
R18  25.08,87.31 270 top
R19  15.24,84.45 90 top
R20  20,88.27 90 top
R21  7.37,81.22 180 top
R23  8.26,93.98 180 top
R24  8.26,91.76 0 top
R26  59.05,95.89 0 top
R28  38.23,97.47 0 top
R29  60.64,88.9 270 top
R30  59.37,23.81 0 top
R31  60.96,14.61 270 top
R32  45.09,9.53 0 top
R33  45.09,25.08 270 top
R34  47.62,25.08 90 top
R35  64.14,86.04 0 top
R36  40.01,20 270 top
R37  59.37,82.87 0 top
R38  36.83,10.79 0 top
R39  12.06,5.71 180 top
R40  43.5,44.13 90 top
R41  49.85,44.77 270 top
R42  42.86,47.62 0 top
R43  34.92,2.54 270 top
R44  37.4,2.54 270 top
R45  21.97,10.54 0 top
R46  30.8,14.61 90 top
R49  33.34,12.7 270 top
R50  12.06,9.53 0 top
R51  21.91,24.13 270 top
R52  10.79,23.81 0 top
R53  7.94,20.95 270 top
R54  25.21,10.6 180 top
R62  39.05,36.2 90 top
R63  36.51,36.2 90 top
R64  23.18,36.83 180 top
R65  40.96,36.2 270 top
R66  42.55,36.2 90 top
R67  18.1,58.74 0 top
R68  40.64,40.01 90 top
R69  40.32,46.04 90 top
R70  34.61,42.86 270 top
R71  28.26,50.8 90 top
R72  30.8,50.8 90 top
R73  20.32,35.88 90 top
R74  28.26,36.83 180 top
R75  25.08,44.13 270 top
R76  15.24,41.27 90 top
R77  20,45.09 90 top
R78  8.51,50.61 180 top
R79  12.06,45.97 270 top
R80  8.26,48.58 0 top
R81  59.05,52.7 0 top
R82  36.83,53.34 0 top
R83  60.64,45.72 270 top
R84  64.45,52.39 0 top
R85  59.37,39.69 0 top
RATE  66.04,70.17 0 bottom
RATE2  66.04,26.99 0 bottom
RELEASE  6.67,87.63 90 bottom
RELEASE2  6.67,44.45 90 bottom
RT1  51.67,93.53 90 top
RT2  44.97,3.62 90 top
RT3  53.27,51.11 90 top
RT4  24.22,3.11 90 top
SUSTAIN  19.05,87.63 90 bottom
SUSTAIN2  19.05,44.45 90 bottom
TRIG  51.88,20.4 180 bottom
TRIG2  17.27,20.4 0 bottom
TRIG_LED  63.5,82.87 180 bottom
TRIG_LED2  63.5,39.69 180 bottom

### Tracks (layer width: path | path; a pad name or v marks a point on that pad's centre or on a via)
ENV  (via drill 0.35)
  Top 0.254: v10.67,21.91 10.79,21.91 13.43,19.27 13.43,18.81 16.44,15.79 17.86,15.79 20.91,12.75 26.62,12.75 27.7,11.67 29.72,11.67 32.74,8.66 32.74,6.81 Q14.1 33.98,4.45 33.97,4.45 34.29,4.13 34.92,4.13 R43.1 | AOP2.1 AOP2.2 8,83.82 v8,85.6 | AOP2.1 5.78,83.76 v5.71,83.82 | R21.2 6.52,83.61 AOP2.1 | v32.77,93.85 33,93.85 34.45,92.41 36.67,92.41 37.15,92.88 AOP1.6
  Bottom 0.254: v10.67,21.91 7.62,21.91 3.49,26.04 3.49,28.52 4.02,29.05 4.02,43.6 2.86,44.77 2.86,55.24 4.02,56.41 4.02,57.69 3.42,58.3 3.42,73.78 4.02,74.39 4.02,83.08 4.76,83.82 v5.71,83.82 | v32.77,93.85 29.97,91.06 13.46,91.06 v8,85.6
ENV1  (via drill 0.35)
  Top 0.254: AOP6.2 7.94,41.91 7.3,42.55 5.4,42.55 3.58,44.36 3.58,47.31 4.11,47.83 4.75,47.83 5.4,48.48 5.4,50.04 v6.03,50.67 6.1,50.61 R78.2 | AOP6.1 6.67,37.47 5.71,36.51 5.71,28.82 6.41,28.12 6.41,19.11 v6.35,19.05 | AOP5.6 37.15,49.55 37.47,49.23 v37.78,49.23 | Q15.1 20.32,8.44 20.32,8.57 19.05,9.84 v19.05,10.79 19.3,10.54 R45.1
  Top 0.406: AOP6.2 AOP6.1
  Bottom 0.254: v19.05,10.79 18.1,11.75 15.88,11.75 8.57,19.05 v6.35,19.05 | v37.78,49.23 35.41,49.23 34.07,50.57 28.8,50.57 28.26,51.12 6.48,51.12 v6.03,50.67
EOD  (via drill 0.35)
  Top 0.254: v61.57,85.09 61.59,85.1 61.59,86.04 | 61.59,86.04 61.59,88.27 | Q12.2 60.96,93.66 61.59,93.04 61.59,88.27 | LFO.P$1 61.59,88.27 | R35.1 61.59,86.04
  Bottom 0.254: EOD.P$1 42.2,2.06 48.1,7.97 48.1,10.27 49.78,11.95 52.4,11.95 59.59,19.14 59.59,24.11 63.11,27.62 66.04,27.62 66.88,28.46 66.88,84.45 66.25,85.09 v61.57,85.09
EOD1
  Top 0.254: LFO2.P$1 61.91,45.09 61.59,45.4 61.59,47.16 61.59,47.17 61.59,49.37 Q33.2 62.38,52.39 R84.1
  Bottom 0.254: EOD2.P$1 15.77,2.06 16.93,3.22 42.32,3.22 47.4,8.3 47.4,10.4 51.17,14.16 52.9,14.16 54.59,15.85 54.59,16.78 58.74,20.93 58.74,27.13 62.57,30.97 64.77,30.97 66.04,32.24 66.04,44.77 65.72,45.09 LFO2.P$1
GATE1  (via drill 0.35)
  Top 0.254: R1.1 64.76,14.07 GATE.P$1 61.02,15.4 R31.1 60.82,15.6 55.98,15.6 55.9,15.67 55.9,16.78 55.52,17.17 54.97,17.17 54.95,17.14 48.9,17.14 48.05,17.98 v48.05,18.19
  Bottom 0.254: GATE2.P$2 29.46,17.47 36.09,17.47 36.98,18.37 47.88,18.37 v48.05,18.19
GND  (via drill 0.2, 0.25, 0.35)
  Top 0.254: D16.A 31.89,38.73 v31.75,38.73 | R14.2 27,94.83 27,94.82 v27,93.98 | R63.2 v37.68,37.05 | C16.2 v36.83,39.79
  Bottom 0.254: v27,93.98 26.99,93.98 | v37.68,37.05 37.78,36.95
  other vias: 26.04,80.01 34.29,81.92 58.42,87.95 56.83,87.95 8.89,42.8 10.54,47.75 17.4,47.62 17.27,63.75 6.48,65.41 25.4,63.75 55.37,99.19 57.02,10.41 32.13,1.65 1.91,2.03 1.78,38.86 2.29,84.33 15.75,94.49 32.13,101.47 32,75.95 47.12,49.53 57.4,42.8 55.75,35.18 52.58,64.01 60.2,73.41 67.31,104.65
  pour Bottom: -3.56,0 -3.56,106.36 68.9,106.36 68.9,0
  pour Top: -12.04,-8.71 -12.04,106 82.36,106 82.36,-8.71
N$1
  Top 0.254: R79.1 12.06,47.75 11.24,48.58 R80.2 9.11,45.88 AOP6.6
N$2
  Top 0.254: Q1.2 48.73,90.14 D2.A
N$3  (via drill 0.35)
  Top 0.254: D7.A 61.26,17.14 61.84,16.56 65.57,16.56 R1.2 66.36,16.53 v66.65,16.83 | v52.07,86.04 51.89,85.86 D1.C 48.91,85.86 Q1.1
  Bottom 0.254: v66.65,16.83 67.29,17.46 67.29,84.79 66.04,86.04 v52.07,86.04
N$4
  Top 0.254: Q3.1 32.07,79.37 32.07,79.38 32.51,79.81 34.49,79.81 35.77,78.53 R6.1 R5.1
N$5
  Top 0.254: R3.1 44.77,84.88 Q2.1
N$6
  Top 0.406: L1.2 48.42,67.35 50.67,69.6 57.98,69.6 58.61,68.96 JP1.2 JP1.1
N$7
  Top 0.254: R2.1 R3.2 44.66,86.68 46.21,86.68 Q1.3
N$8  (via drill 0.35, 0.45)
  Top 0.254: AOP1.3 36.97,88.66 D3.C 36.97,84.64 v37.15,84.45 | v8,79.38 8,81 R21.1
  Bottom 0.254: v37.15,84.45 31.18,90.42 16.38,90.42 8,82.04 v8,79.38
N$9
  Top 0.254: Q3.2 33.97,77.47 33.66,77.15 31.43,77.15 30.48,78.11 30.48,80.01 | 30.48,80.01 30.48,89.53 Q5.2 | R7.1 24.03,79.48 24.77,78.74 28.16,78.74 R17.1 30.48,80.01
N$10  (via drill 0.35)
  Top 0.254: Q4.1 26.45,71.12 R9.1 26.7,70.94 27.52,70.94 29.29,72.71 v35.24,72.71 | v37.78,76.2 39.05,77.47 40.01,77.47 R8.2
  Bottom 0.254: v35.24,72.71 35.24,73.66 36.26,74.68 36.28,74.68 37.19,75.59 37.19,75.6 v37.78,76.2
N$11
  Top 0.254: AOP1.5 48.41,94.04 RT1.2 | 38.95,96.42 39.05,96.52 39.05,97.45
  Top 0.305: 39.05,97.45 R28.2 39.08,98.53 38.03,99.58 38.03,102.83 C4.1 | 38.95,96.42 38.42,95.89 AOP1.5
N$12
  Top 0.254: Q7.2 18.25,81.28 18.25,83.49 18.43,83.68 18.45,83.68 18.61,83.84 18.61,84.97 19.05,85.41 Q6.2
N$13
  Top 0.254: R11.2 40.64,85.59 D3.A 40.32,86.81 40.32,88.05 R12.1
N$14
  Top 0.254: 34.61,88.58 AOP1.1 34.61,90.81 35.24,91.44 40.01,91.44 40.64,90.81 R12.2 | 34.61,88.58 R13.1 | D5.A 32.88,88.58 34.61,88.58
N$15  (via drill 0.45)
  Top 0.254: D4.C 35.74,84.69 35.24,85.19 R13.2 32.49,85.19 v32.38,85.09 | v29.53,85.72 28.26,85.72 26.67,87.31 23.64,87.31 21.66,85.33 21.66,84.21 20.96,83.5 Q6.1
  Bottom 0.254: v32.38,85.09 30.16,85.09 v29.53,85.72
N$16
  Top 0.254: D5.C 31.43,90.98 30.62,90.17 29.68,90.17 Q5.1 28.58,92.81 R14.1
N$17
  Top 0.254: Q5.3 29.99,91.27 30.48,91.76 30.48,92.79 30.47,92.8 R15.1 32.92,93.13 34.16,91.89 42.22,91.89 D6.A
N$18
  Top 0.254: ATTACK.2 46.46,75.53 46.46,76.87 47.62,78.04 47.62,81.28 48.81,82.46 51.92,82.46 54.61,85.15 54.61,90.39 49.25,95.75 D6.C 43.18,103.5 43.81,104.13 ATTACK.3
N$19
  Top 0.254: 19.05,75.25 19.05,73.98 19.05,73.97 Q8.2 19.05,75.25 | Q7.1 18.41,78.74 19.27,77.89 R16.1 20.32,76.52 19.05,75.25
N$20
  Top 0.254: R17.2 27.73,81.98 27.72,81.99 Q9.1
N$21  (via drill 0.35)
  Top 0.254: R10.2 19.05,94.51 v19.05,95.55 19.05,102.38 SUSTAIN.3
  Top 0.406: AOP1.2 v35.88,90.49
  Bottom 0.254: v35.88,90.49 35.88,94.04 34.35,95.57 19.05,95.57 v19.05,95.55
N$22
  Top 0.254: Q9.3 Q10.1 25.08,86.15 R18.2
N$23  (via drill 0.45)
  Top 0.254: v19.37,81.92 23.96,81.92 Q10.3 | v17.46,81.92 15.88,81.92 15.24,82.55 R19.1
  Bottom 0.254: v17.46,81.92 v19.37,81.92
N$24
  Top 0.254: Q6.3 17.63,86.31 18.73,87.42 R20.1
N$25  (via drill 0.45)
  Top 0.254: v22.23,89.22 22.12,89.11 R20.2 20,90.81 21.59,92.39 21.59,101.92 23.8,104.13 DECAY.3
  Bottom 0.254: v22.23,89.22 24.77,89.22 29.68,84.3 DECAY.2
N$26
  Top 0.254: RELEASE.2 4.92,85.72 3.49,87.15 3.49,91.6 3.71,91.82 3.71,98.51 4.36,99.15 4.36,101.18 7.3,104.13 RELEASE.3 8.9,104.13 12.7,100.33 12.7,87.84 R19.2
N$27
  Top 0.254: ATTACK.1 44.28,69.85 36.69,69.85 35.41,71.13 DECAY.1 33.18,70.01 32.32,69.15 16.26,69.15 14.28,71.13 RELEASE.1
  Top 0.508: C2.+ 50.16,73.5 50.16,72.39 48.91,71.13 ATTACK.1 | RELEASE.1 7.29,71.13 6.67,71.75 C1.+ 9.21,77.26 AOP2.3
N$28
  Top 0.254: Q4.3 22.71,71.75 22.09,71.13 SUSTAIN.1
N$29
  Top 0.254: AOP2.6 9.21,91.66 R24.2 R23.1
N$30  (via drill 0.35)
  Top 0.254: AOP3.2 AOP3.1 36.54,64.17 37.59,63.12 45.59,63.12 45.86,62.85 45.97,62.85 48.39,60.43 48.39,59.44 52.7,55.12 v64.01,55.12 | ENV_OUT.P$1 68.26,6.83 68.26,53.14 66.8,54.6 66.8,54.61 65.65,55.76 v65.65,56.26
  Bottom 0.254: v65.65,56.26 64.51,55.12 v64.01,55.12
N$31
  Top 0.254: R30.2 60.65,24.24 62.55,24.24 63.09,24.24 GATE.P$2
N$32
  Top 0.254: R4.2 43.4,79.38 | 43.4,79.38 42.86,79.38 42.01,80.22 R5.2 R8.1 | 43.4,79.38 43.67,79.38 Q2.3
N$33
  Top 0.254: RT1.1 55.82,94.68 57.02,95.89 R26.1
N$34  (via drill 0.35)
  Top 0.254: R54.2 22.88,10.6 | R45.2 22.88,10.6 | v13.46,37.21 13.46,43.73 R79.2 12.06,45.38 12.89,46.21 12.89,50.73 9.31,54.31 9.31,59.22 v10.03,59.94 | v19.94,11.2 20.33,11.2 20.5,11.37 22.12,11.37 22.88,10.6 | v9.78,65.66 12.1,67.98 AOP3.5
  Bottom 0.254: v13.46,37.21 13.46,32.66 13.02,32.22 13.02,16.84 14.35,15.51 17.73,15.51 19.96,13.28 19.96,11.22 v19.94,11.2 | v9.78,65.66 10.03,65.41 v10.03,59.94
N$35
  Top 0.254: D8.A 42.37,15.1 40.01,17.46 R36.2
N$36
  Top 0.254: R44.1 41.99,3.39 RT2.2 46.57,3.62 RT2.1
N$37
  Top 0.254: D9.A 51.58,15.1 TRIG.P$1
N$38
  Top 0.254: D7.C 56.97,22.09 53.98,25.08 49.85,25.08 48.9,24.13 47.73,24.13 R34.1 R33.2 45.26,24.06 Q11.3
N$39  (via drill 0.45)
  Top 0.254: R29.1 60.47,89.92 Q12.1 57.15,91.76 57.15,92.46 56.13,93.47 53.34,93.47 50.61,96.2 47.62,96.2 44.13,99.69 v44.13,100.97 | v42.47,100.97 41.49,101.95 C5.2
  Bottom 0.254: v44.13,100.97 v42.47,100.97
N$40
  Top 0.254: R36.1 40.01,21.01 MANUAL_TRIG.3
N$41
  Top 0.254: RATE.P$2 60.33,75.25 58.74,73.66 C2.-
N$42
  Top 0.254: C3.+ 50.32,79.53 50.48,79.38
  Top 0.508: RATE.P$1 61.28,77.79 60.64,77.15 52.7,77.15 50.48,79.38 50.48,80.8 C3.+
N$43
  Top 0.254: Q13.2 58.52,81.01 R37.1
N$44
  Top 0.254: R37.2 TRIG_LED.A
N$45
  Top 0.254: R38.1 35.98,5.61 35.94,5.57 Q14.2
N$46
  Top 0.254: R38.2 37.68,13.68 ENV_LED.A
N$47
  Top 0.254: D12.A 51.62,42.23 50.48,42.23 49.21,40.96 47.79,40.96 Q17.2
N$48  (via drill 0.35)
  Top 0.254: v67.61,13.65 65.62,11.67 62.67,11.67 59.66,8.66 59.66,4.94 56.78,2.06 ENV_OUT_INV.P$1 | AOP2.7 7.94,90.49 7.41,91.02 R24.1 6.71,92.46 v6.22,92.46
  Bottom 0.254: v67.61,13.65 67.86,13.9 67.86,85.18 66.36,86.68 57.02,86.68 55.88,87.82 55.88,87.88 55.63,88.14 54.17,88.14 45.85,96.46 7.94,96.46 6.22,94.74 v6.22,92.46
N$49  (via drill 0.35)
  Top 0.254: v3.05,93.73 3.09,93.69 3.09,86.98 4.02,86.05 4.02,72.35 3.68,72.02 3.68,70.23 5.33,68.58 29.97,68.58 31.84,66.71 AOP3.3 34.01,67.34 35.69,67.34 36.41,68.07 38.48,68.07 39.75,66.8 39.75,66.67 40.01,66.42 v40.01,65.28 | R23.2 7.15,93.73 v4.7,93.73 | R43.2 R44.2 36.57,2.52 36.57,4.67 36.65,4.75 36.65,7.7 38.73,9.78 38.73,13.84 38.51,14.06 38.51,14.7 35.81,17.4 v35.81,23.11 | v40.64,51.94 40.64,54.1 v41.02,54.48
  Bottom 0.254: v3.05,93.73 v4.7,93.73 | v35.81,23.11 40.89,28.19 40.89,28.44 46.35,33.91 46.35,46.23 v40.64,51.94 | v40.01,65.28 40.01,63.63 41.27,62.36 41.27,54.74 v41.02,54.48
N$50
  Top 0.254: R39.1 12.91,4.87 14.43,3.35 18.95,3.35 Q15.2
N$51  (via drill 0.35)
  Top 0.254: R39.2 10.16,5.71 9.84,6.03 9.84,9.21 6.99,12.06 6.99,13.97 5.4,15.56 v3.52,15.56
  Bottom 0.254: v3.52,15.56 ENV_LED1.A
N$52  (via drill 0.35, 0.45)
  Top 0.254: v32.36,18.41 30.8,16.85 R46.2 30.65,15.6 25.94,15.6 D21.A D11.C | Q17.1 45.72,40.01 v45.4,39.69
  Bottom 0.254: v32.36,18.41 32.36,21.91 36.51,26.06 36.51,31.73 44.47,39.69 v45.4,39.69
N$53
  Top 0.254: R41.1 47.88,45.62 Q18.1
N$54
  Top 0.254: R41.2 49.74,43.81 47.16,43.81 Q17.3 46.63,43.33 46.67,43.28 R40.1
N$55
  Top 0.254: R65.1 R62.2 39.99,37.99 40.92,37.99 41.91,38.98 41.91,43.2 41.57,43.54 41.57,44.74 43.5,46.67 43.71,46.67 | R42.2 43.71,46.67 | 43.71,46.67 Q18.3
N$56
  Top 0.406: L2.2 40.89,65.69 40.89,64.52 41.81,63.6 47.12,63.6 48.9,61.82 48.9,60.07 50.16,58.8 JP1.9
  Top 0.61: JP1.10 JP1.9
N$57
  Top 0.406: L1.1 47.91,68.83 D14.A
N$58
  Top 0.254: GATE2.P$1 31.75,25.4 33.34,23.81 R49.1 33.34,13.53 33.11,13.76 R46.1
N$59
  Top 0.406: D13.C 43.69,65 L2.1
N$60
  Top 0.254: R54.1 26.06,5.49 26.06,5.44 26.06,4.98 26.04,4.95 | RT4.2 22.81,4.45 25.53,4.45 26.04,4.95 | 26.04,4.95 26.27,4.95 RT4.1
N$61
  Top 0.254: D21.C 23,17.14 21.91,18.23 21.91,23.18 | Q16.3 9.95,17.85 R52.1 9.95,24.55 10.16,24.77 16.34,24.77 16.82,24.3 19.52,24.3 20.64,23.18 21.91,23.18 | R51.2 21.91,23.18
N$62  (via drill 0.35)
  Top 0.254: D19.A 14.61,16.87 v14.35,16.87
  Bottom 0.254: v14.35,16.87 14.32,16.9 14.32,24.16 15.56,25.4 TRIG2.P$1
N$63
  Top 0.254: D22.A 8.26,15.1 6.82,16.54 6.82,17.65 7.94,18.77 R53.2
N$64
  Top 0.254: MANUAL_TRIG2.3 8.04,21.91 R53.1
N$65
  Top 0.254: AOP3.7 AOP3.6 23.06,66.71 23,66.76 17.27,66.76 14.22,63.71 9.51,63.71 4.51,58.71 4.51,52.64 4.38,52.51 4.38,50.68 2.13,48.43 2.13,43.96 4.02,42.08 4.02,30.84 0.86,27.69 0.86,6.74 4.31,3.29 12.96,3.29 15.37,0.89 27.72,0.89 ENV_OUT2.P$1
N$70  (via drill 0.35)
  Top 0.254: v18.73,50.46 18.73,58.52 R67.2 20.8,60.59 SUSTAIN2.3
  Top 0.406: v36.51,47.28 35.88,46.65 AOP5.2
  Bottom 0.254: v36.51,47.28 33.63,50.16 28.64,50.16 28.34,50.46 v18.73,50.46
N$71
  Top 0.254: Q26.3 21.27,28.57 20.8,28.1 SUSTAIN2.1
N$84
  Top 0.254: Q25.1 32.07,36.19 32.07,36.2 32.51,36.63 34.49,36.63 35.77,35.34 R63.1 R62.1
N$85
  Top 0.254: Q25.2 33.97,34.29 33.66,33.97 31.43,33.97 30.48,34.92 30.48,36.83 | 30.48,36.83 30.48,46.35 Q27.2 | R64.1 24.03,36.3 24.77,35.56 27.84,35.56 R74.1 30.48,36.83
N$86
  Top 0.254: Q26.1 26.48,27.62 28.87,30.02 40.18,30.02 42.55,32.38 R66.1 R65.2
N$87  (via drill 0.45)
  Top 0.254: AOP5.3 36.97,45.48 D15.C 36.97,41.09 v36.83,40.96 | R78.1 11.3,50.61 12.06,49.85 v12.06,48.9
  Bottom 0.254: v12.06,48.9 28.89,48.9 v36.83,40.96
N$88
  Top 0.254: R68.2 40.64,42.41 D15.A 40.32,43.63 R69.1
N$89
  Top 0.254: 34.61,45.4 AOP5.1 34.61,47.62 34.92,47.94 40.32,47.94 R69.2 | 34.61,45.4 R70.1 | D17.A 32.88,45.4 34.61,45.4
N$90  (via drill 0.45)
  Top 0.254: D16.C 34.79,41.83 R70.2 33.34,42.01 v33.34,41.91 | v29.53,42.55 27.94,44.13 23.64,44.13 21.66,42.16 21.66,41.03 20.96,40.33 Q28.1
  Bottom 0.254: v33.34,41.91 33.02,42.23 29.84,42.23 v29.53,42.55
N$91
  Top 0.254: D17.C 31.98,47.4 30.57,47.4 30.04,46.87 29.86,46.87 29.7,46.71 29.7,46.69 29.21,46.21 28.89,46.21 Q27.1 28.58,49.63 R71.1
N$92
  Top 0.254: Q27.3 29.99,48.09 30.8,48.9 30.8,49.29 30.47,49.62 R72.1 32.92,49.95 34.29,48.58 42.09,48.58 D18.A
N$93
  Top 0.254: ATTACK2.2 46.04,31.92 46.04,37.15 48.17,39.28 52.24,39.28 54.29,41.34 54.29,48.87 51.94,51.22 51.94,52.04 51.41,52.57 D18.C 43.18,58.66 45.47,60.95 ATTACK2.3
N$94
  Top 0.254: Q29.2 18.25,38.1 18.25,40.31 18.43,40.5 18.45,40.5 18.61,40.66 18.61,41.79 19.05,42.23 Q28.2
N$95
  Top 0.254: Q30.2 19.05,32.07 20.32,33.34 R73.1 19.27,35.03 18.73,35.56 Q29.1
N$97
  Top 0.254: R74.2 27.3,37.36 27.3,38.59 Q31.1
N$98
  Top 0.254: Q31.3 Q32.1 25.08,42.97 R75.2
N$99  (via drill 0.45)
  Top 0.254: v19.37,38.73 19.68,39.05 23.98,39.05 Q32.3 | v17.46,38.73 15.88,38.73 15.24,39.37 R76.1
  Bottom 0.254: v17.46,38.73 v19.37,38.73
N$100
  Top 0.254: Q28.3 17.63,43.13 18.73,44.23 R77.1
N$101  (via drill 0.45)
  Top 0.254: v22.23,46.04 22.12,45.94 R77.2 20,47.62 21.59,49.21 21.59,57.09 25.45,60.95 DECAY2.3
  Bottom 0.254: v22.23,46.04 24.77,46.04 29.68,41.12 DECAY2.2
N$102
  Top 0.254: R76.2 15.11,42.25 15.11,52.2 12.83,54.48 12.83,58.27 10.29,60.8 8.56,60.8 RELEASE2.3 8.29,60.95 4.92,57.58 4.92,48.58 4.58,48.24 3.79,48.24 3.17,47.62 3.17,44.13 5.17,42.14 5.17,28.2 RELEASE2.2
N$103
  Top 0.254: ATTACK2.1 44.37,26.75 44.36,26.76 36.6,26.76 35.41,27.95 DECAY2.1 32.06,27.95 30.8,29.21 29.21,29.21 25.76,25.76 21.24,25.76 21.2,25.72 19.37,25.72 18.41,26.67 15.56,26.67 14.28,27.95 RELEASE2.1
  Top 0.508: C11.+ 50.16,30.32 50.16,29.21 48.91,27.95 ATTACK2.1 | RELEASE2.1 7.29,27.95 6.99,28.26 C15.+ 9.21,33.76 AOP6.3
N$105  (via drill 0.35)
  Top 0.254: v6.05,49.53 6.99,49.53 7.41,49.11 R80.1 7.41,47.84 7.94,47.31 AOP6.7 | v4.13,48.9 3.17,48.9 2.54,48.26 2.54,44.13 4.76,41.91 4.76,30.8 1.27,27.3 1.27,7.17 4.45,3.98 12.91,3.98 14.83,2.06 ENV_OUT_INV2.P$1
  Bottom 0.254: v4.13,48.9 4.76,49.53 v6.05,49.53
N$106
  Top 0.254: R81.1 57.76,52.26 RT3.1
N$107
  Top 0.254: C13.1 37.68,59.37 R82.2 38.42,53.34 AOP5.5 50.27,50.86 RT3.2
N$109  (via drill 0.45)
  Top 0.254: R83.1 60.47,46.74 Q33.1 55.16,48.58 52.45,51.29 52.45,52.13 51.56,53.02 47.62,53.02 44.13,56.52 v44.13,57.78 | v42.47,57.78 41.49,58.77 C14.2
  Bottom 0.254: v44.13,57.78 v42.47,57.78
N$110
  Top 0.508: RATE2.P$2 60.33,32.07 58.74,30.48 C11.-
N$111
  Top 0.254: C12.+ 50.32,36.35 50.48,36.2
  Top 0.508: RATE2.P$1 62.23,33.34 53.34,33.34 50.48,36.2 50.48,37.62 C12.+
N$112
  Top 0.254: Q34.2 58.52,37.83 R85.1
N$113
  Top 0.254: TRIG_LED2.A R85.2
SUST_STATE  (via drill 0.35)
  Top 0.254: C5.1 39.79,103.72 39.37,104.14 36.83,104.14 36.3,103.61 C4.2 36.3,100.56 37.38,99.48 R28.1 37.38,97.05 36.04,95.72 | Q13.1 60.81,80.96 62.55,80.96 63.5,81.92 63.5,82.93 61.99,84.43 61.3,84.43 61.28,84.45 57.15,84.45 55.27,86.34 v55.27,86.83 | v35.25,95.72 36.04,95.72 | 36.04,95.72 35.88,95.55 AOP1.7
  Bottom 0.254: v55.27,86.83 54.46,86.83 45.7,95.59 35.37,95.59 v35.25,95.72
SUST_STATE2  (via drill 0.35)
  Top 0.254: AOP5.7 35.88,53.24 R82.1 35.98,54 37.19,55.21 37.19,56.49 36.3,57.38 C13.2 36.3,60.43 36.83,60.96 39.37,60.96 | C14.1 39.79,60.54 39.37,60.96 | Q34.1 61.76,38.73 63.18,38.73 63.18,41.27 60.37,44.09 59.98,44.09 59.81,44.25 59.81,44.64 58.1,46.35 v55.24,46.35 | 39.37,60.96 42.93,60.96 44.42,62.45 45.8,62.45 47.38,60.87 47.38,59.62 v52.7,54.29
  Bottom 0.254: v52.7,54.29 53.33,53.66 53.42,53.66 55.27,51.81 55.27,46.38 v55.24,46.35
SUSTAIN_LVL  (via drill 0.35)
  Top 0.254: 17.3,72.39 17.3,73.68 Q8.1 | 17.3,72.39 SUSTAIN.2 | 17.3,72.39 20,72.39 22.23,74.61 25.4,74.61 26.63,73.38 36.47,73.38 37.15,72.71 42.55,72.71 46.04,76.2 46.04,77.15 47.15,78.26 47.15,82.39 47.62,82.87 51.75,82.87 53.98,85.09 53.98,88.9 52.83,90.04 v52.83,91.06 | v53.12,92.81 53.98,92.81 RT1.3
  Bottom 0.254: v52.83,91.06 52.83,92.53 v53.12,92.81
SUSTAIN_LVL1  (via drill 0.35)
  Top 0.254: 17.3,29.84 17.3,30.82 Q30.1 | SUSTAIN2.2 17.3,29.84 | 17.3,29.84 17.78,29.84 18.73,28.89 18.73,26.99 19.6,26.12 21.03,26.12 21.07,26.17 25.59,26.17 29.04,29.62 40.41,29.62 45.4,34.61 45.4,37.47 47.94,40.01 52.07,40.01 53.59,41.53 v53.59,48.64 | v54.61,50.52 55.17,49.96 RT3.3
  Bottom 0.254: v53.59,48.64 53.59,49.51 v54.61,50.52
TRIG  (via drill 0.35)
  Top 0.254: R32.1 44.23,11.78 D8.C D10.C 47.31,12.2 | 47.31,12.2 D9.C | 47.31,12.2 47.4,12.29 47.4,16.51 | Q11.1 47.4,20.27 47.4,16.51 | v65.55,80.79 66.36,81.6 66.36,90.49 66.04,90.81 LFO.P$2 | v55.24,16.51 47.4,16.51
  Bottom 0.254: v55.24,16.51 56.2,16.51 59.19,19.5 59.19,24.28 62.94,28.03 65.87,28.03 66.47,28.63 66.47,79.87 v65.55,80.79
TRIG1  (via drill 0.35)
  Top 0.254: v61.91,37.61 65.55,37.61 66.36,38.42 66.36,47.31 66.04,47.62 LFO2.P$2 | R50.1 11.21,10.2 D22.C D20.C | D20.C 12.47,12.2 12.47,16.57 Q16.1 | D20.C D19.C 15.74,12.2 16.07,11.87 25.97,11.87 v26.1,12
  Bottom 0.254: v26.1,12 26.23,11.87 42.67,11.87 48.9,18.1 48.9,25.08 61.42,37.61 v61.91,37.61
VCC  (via drill 0.35, 0.4 pad 0.6, 0.45)
  Top 0.152: 33.8,7.77 v33.66,7.62
  Top 0.254: R40.2 43.6,45.09 46.35,45.09 46.67,45.4 46.67,47.31 46.99,47.62 Q18.2 | 33.81,54.13 33.88,54.07 | R11.1 40.96,81.7 40.96,80.96 v41.59,80.96 | v33.66,7.62 34.81,7.62 | 17.25,50.56 v17.14,50.46 | R10.1 20.64,94.19 v20.64,92.86 | 6.67,47.7 AOP6.8 | 5.21,45.19 C9.2 | v6.11,91.31 5.4,90.61 C7.2 6.19,88.96 AOP2.8 | C8.2 32.28,95.91 32.26,95.89
  Top 0.406: v6.11,48.26 6.67,47.7 | Q25.3 32.99,37.64 32.99,40.75 31.14,42.61 v31.14,43.18 | v29.82,43.81 29.19,43.81 28.23,44.77 25.08,44.77 | Q13.3 52.85,78.59 v52.7,78.74 | R67.1 17.25,50.56 | D14.C 45.59,65.03 45.34,64.77 48.9,64.77 50.91,62.76 C19.+ 50.93,60.94 v50.93,59.56
  Top 0.508: R26.2 59.91,94.83 59.64,94.57 59.6,94.57 59.02,93.98 58.1,93.98 58.1,92.88 Q12.3 | Q13.3 61.13,78.59 61.59,79.06 65.72,79.06 65.88,78.9 | 65.88,78.9 65.75,78.77 65.75,68.33 64.77,67.34 64.77,55.88 66.61,54.04 | 65.88,78.9 67.31,80.33 67.31,95.89 R26.2 | R2.2 42.55,84.88 42.55,81.75 Q2.2 42.27,82.02 R11.1 40.32,81.7 35.66,81.7 34.76,80.79 Q3.3 31.14,82.67 v31.14,86.04 | Q8.3 18.1,77.3 17.93,77.47 14.29,77.47 12.38,79.38 12.38,85.09 10.16,87.31 6.99,87.31 6.67,87.63 AOP2.8 | 60.07,54.04 60.01,53.98 60.01,52.81 R81.2 59.91,51.65 59.64,51.39 59.6,51.39 59.02,50.8 58.1,50.8 58.1,49.7 Q33.3 | 60.07,54.04 60.2,54.17 55.31,54.17 v53.34,52.2 | 66.61,54.04 60.07,54.04 | Q34.3 61.13,35.41 61.91,36.2 67.31,36.2 | 67.31,36.2 67.31,53.34 66.61,54.04 | Q25.3 34.76,37.61 35.66,38.52 40.01,38.52 R68.1 | Q30.3 18.1,34.12 17.93,34.29 14.48,34.29 | v33.97,52.58 34.61,51.94 AOP5.8 | v33.97,52.58 27.18,52.58 25.08,50.48 v25.08,49.6 R75.1 25.08,44.77 | 14.48,34.29 11.11,30.92 v11.11,28.89 | v29.82,87 28.55,87 27.39,88.16 R18.1 v25.08,92.78 25.08,93.66 27.3,95.89 32.26,95.89 33.97,95.89 34.61,95.25 AOP1.8 | 67.31,36.2 67.31,30.48 64.77,27.94 60.96,27.94 58.52,25.5 R30.1 57.15,23.81 53.34,27.62 51.37,27.62 50.16,27.62 49.38,26.84 46.91,26.84 46,25.93 R33.1 37.36,25.93 36.83,25.4 | 34.81,7.62 34.81,23.38 | 34.81,23.38 36.83,25.4 | Q18.2 50.29,47.62 v51.88,49.21 | Q14.3 33.8,7.77 | MANUAL_TRIG.1 38.12,24.11 36.83,25.4 | MANUAL_TRIG2.1 5.27,25.4 v5.71,25.4 | R26.2 v60.96,95.89 | 14.48,34.29 14.29,34.29 12.38,36.2 12.38,41.91 10.41,43.88 7.24,43.88 6.67,44.45 AOP6.8 6.08,45.19 5.21,45.19
  Top 0.508: R51.1 22.15,25.23 25.98,25.23 27.4,26.64 30.22,26.64 30.25,26.67 31.52,26.67 34.81,23.38 | v24.26,5.1 24.34,5.19 Q15.3 | 33.81,54.13 33.66,54.29 C6.2 32.92,56.58 34.93,58.59 34.93,61.1 33.16,62.87 29.47,62.87 AOP3.8 | 33.88,54.07 33.97,53.98 v33.97,52.58
  Bottom 0.406: v6.11,91.31 9.56,91.31 11.11,92.86 v20.64,92.86 25.01,92.86 v25.08,92.78 | v6.11,48.26 8.93,48.26 10.47,49.81 12.39,49.81 12.59,49.6 17.14,49.6 | 17.14,49.6 v25.08,49.6 | v31.14,43.18 30.5,43.81 v29.82,43.81 | 31.82,4.03 31.91,4.03 32.81,4.93 32.81,6.78 v33.66,7.62 | v17.14,50.46 17.14,49.6 | v50.93,59.56 51.02,59.47 51.02,53.34
  Bottom 0.508: v31.14,86.04 30.77,86.04 v29.82,87 | v33.97,52.58 34.73,53.34 51.02,53.34 51.94,52.42 | v52.7,78.74 50.48,80.96 v41.59,80.96 | v5.71,25.4 9.53,25.4 11.11,26.99 v11.11,28.89 | v51.88,49.21 51.94,49.21 51.94,52.42 | v53.34,52.2 52.16,52.2 51.94,52.42 | 31.82,4.03 31.8,4.01 25.23,4.01 24.26,4.98 v24.26,5.1
VDD  (via drill 0.35, 0.45)  (1 unrouted)
  Top 0.254: R9.2 27.05,72.23 v27.88,72.23
  Top 0.406: R16.2 20.74,80.01 R7.2 | v18.73,46.35 18.73,46.52 19.52,47.3 19.52,49.04 19.53,49.05 | R73.2 20.42,36.83 R64.2 25.18,33.97 28.57,33.97 31.13,31.42 36.31,31.42 36.32,31.43 36.57,31.43 38.01,32.87 38.01,33.97 v37.92,34.07 | 43.59,68.95 36.26,68.95 35.28,67.98 AOP3.4 | AOP5.4 v38.42,43.81
  Top 0.508: R16.2 20.32,80.56 20.41,80.64 v20.41,80.96 | R73.2 20.32,37.38 20.41,37.47 v20.41,38.1 | R7.2 25.63,76.71 27.93,76.71 30.25,74.39 v37.06,74.39 38.1,73.34 41.26,73.34 46.35,78.44 v46.35,83.19 | 10.92,40.64 10.54,40.64 AOP6.4 | 19.53,49.05 21.06,50.58 21.06,58.07 22.73,59.75 v22.73,65.34 | R66.2 42.55,42.61 42.54,42.61 42.54,43.5 v42.23,43.81 | AOP3.4 33.36,67.98 v34.91,69.53 v34.92,69.53 | AOP1.4 v38.42,87 C18.1 | 10.92,40.64 10.41,40.13 10.41,38.7 C10.1 | C17.1 10.79,83.44 AOP2.4 10.54,83.82 v11.55,83.82 | 10.92,40.64 v11.55,40.64 | v38.42,43.81 C16.1 | C20.- 50.48,66.57 44.71,66.57 43.72,67.56 D13.A
  Bottom 0.254: v11.55,40.64 17.26,46.35 17.46,46.35
  Bottom 0.406: v38.42,43.81 38.42,36.6 38.52,36.5 38.52,34.67 v37.92,34.07 | v27.88,72.23 27.88,69.59 27.94,69.53
  Bottom 0.508: v11.55,83.82 17.26,89.53 v18.73,89.53 20.2,88.06 20.2,81.17 v20.41,80.96 | v20.41,38.1 20.31,38.1 20.2,38.21 20.2,44.88 v18.73,46.35 17.46,46.35 17.14,46.35 11.55,40.76 v11.55,40.64 | v46.35,83.19 42.23,83.19 v38.42,87 | v38.42,43.81 v42.23,43.81 | v22.73,65.34 26.92,69.53 27.94,69.53 v34.92,69.53 37.06,71.66 v37.06,74.39
(copper drawn outside any net)
  shapes: Top area x17166

### Text on the board
Top: MOUNTS | D:/Images/Inkspace/Upschall/Abschall Vertical Logo Simple.bmp
Bottom: MOUNTS
tPlace: MOUNTS | by Abschall / Rev4 04/2024 | D:/Images/Inkspace/Upschall/Abschall Vertical Logo Simple.bmp | red strip | CC-BY-SA 4.0
bPlace: MOUNTS
bNames: Cycle | Rate | Cycle | Rate